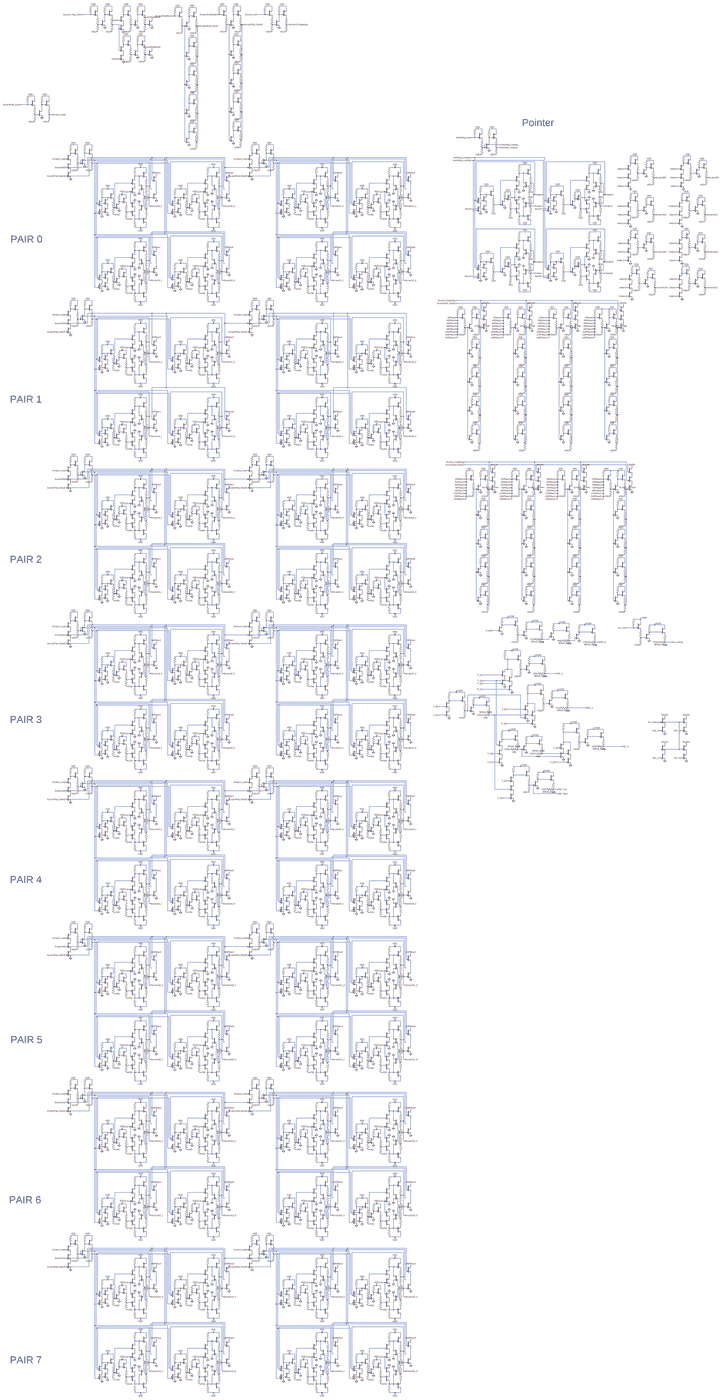
[diagram p0: schematic scratch pad.asc, whole sheet]
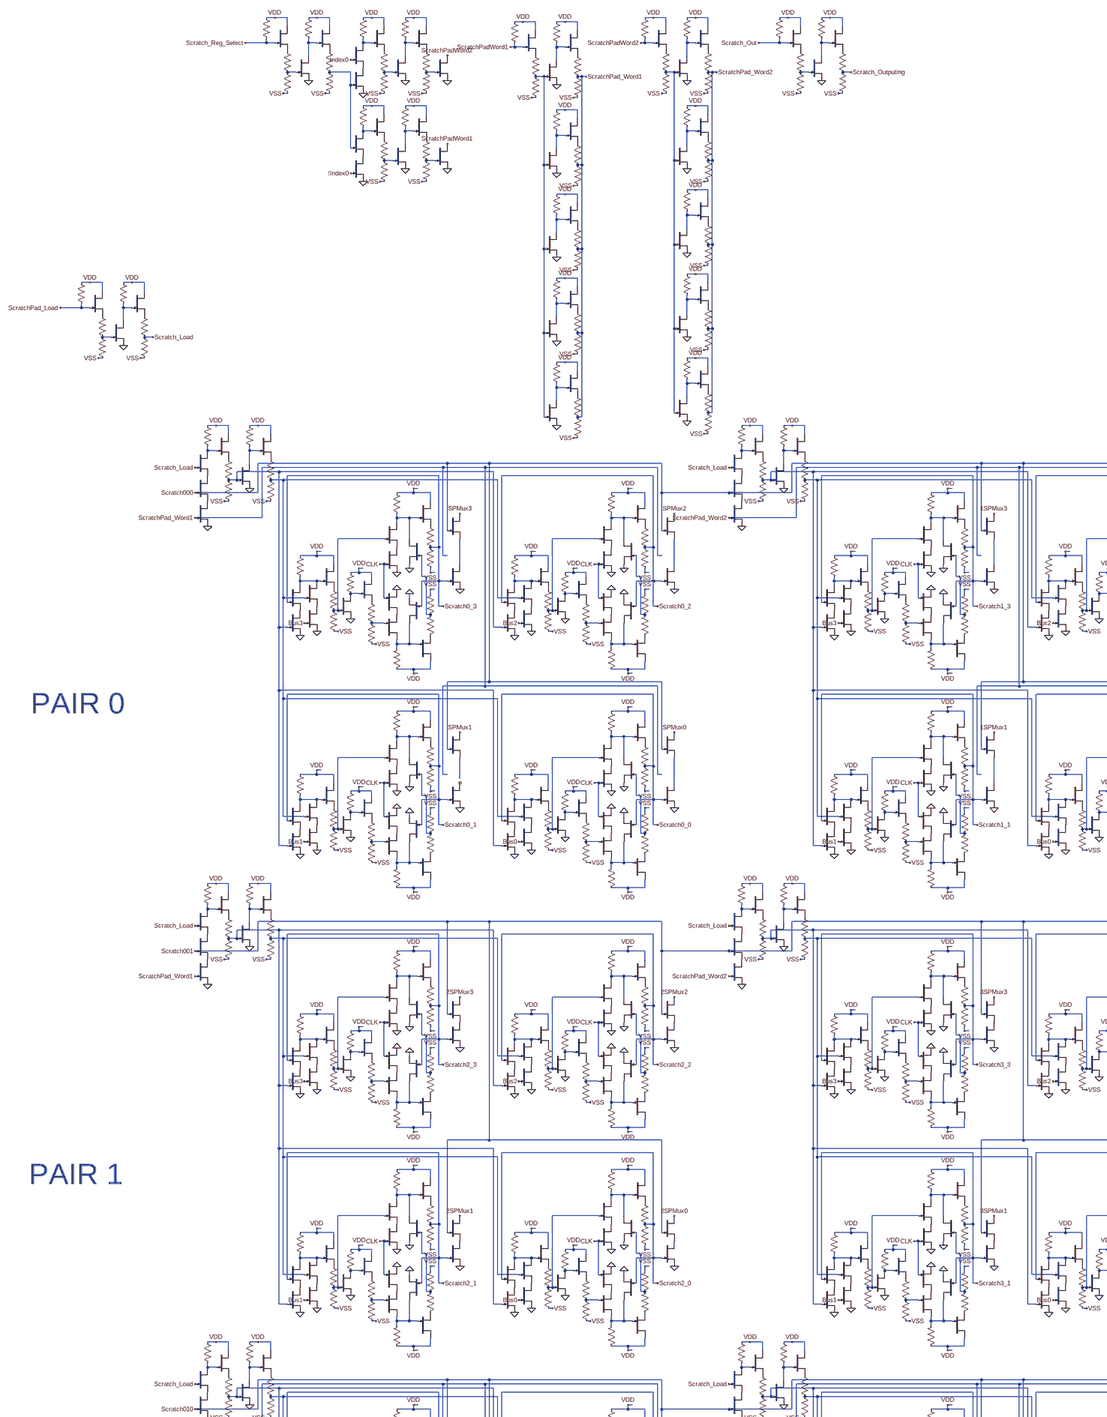
[diagram p1: schematic scratch pad.asc, part, row 1 of 3, column 1 of 2]
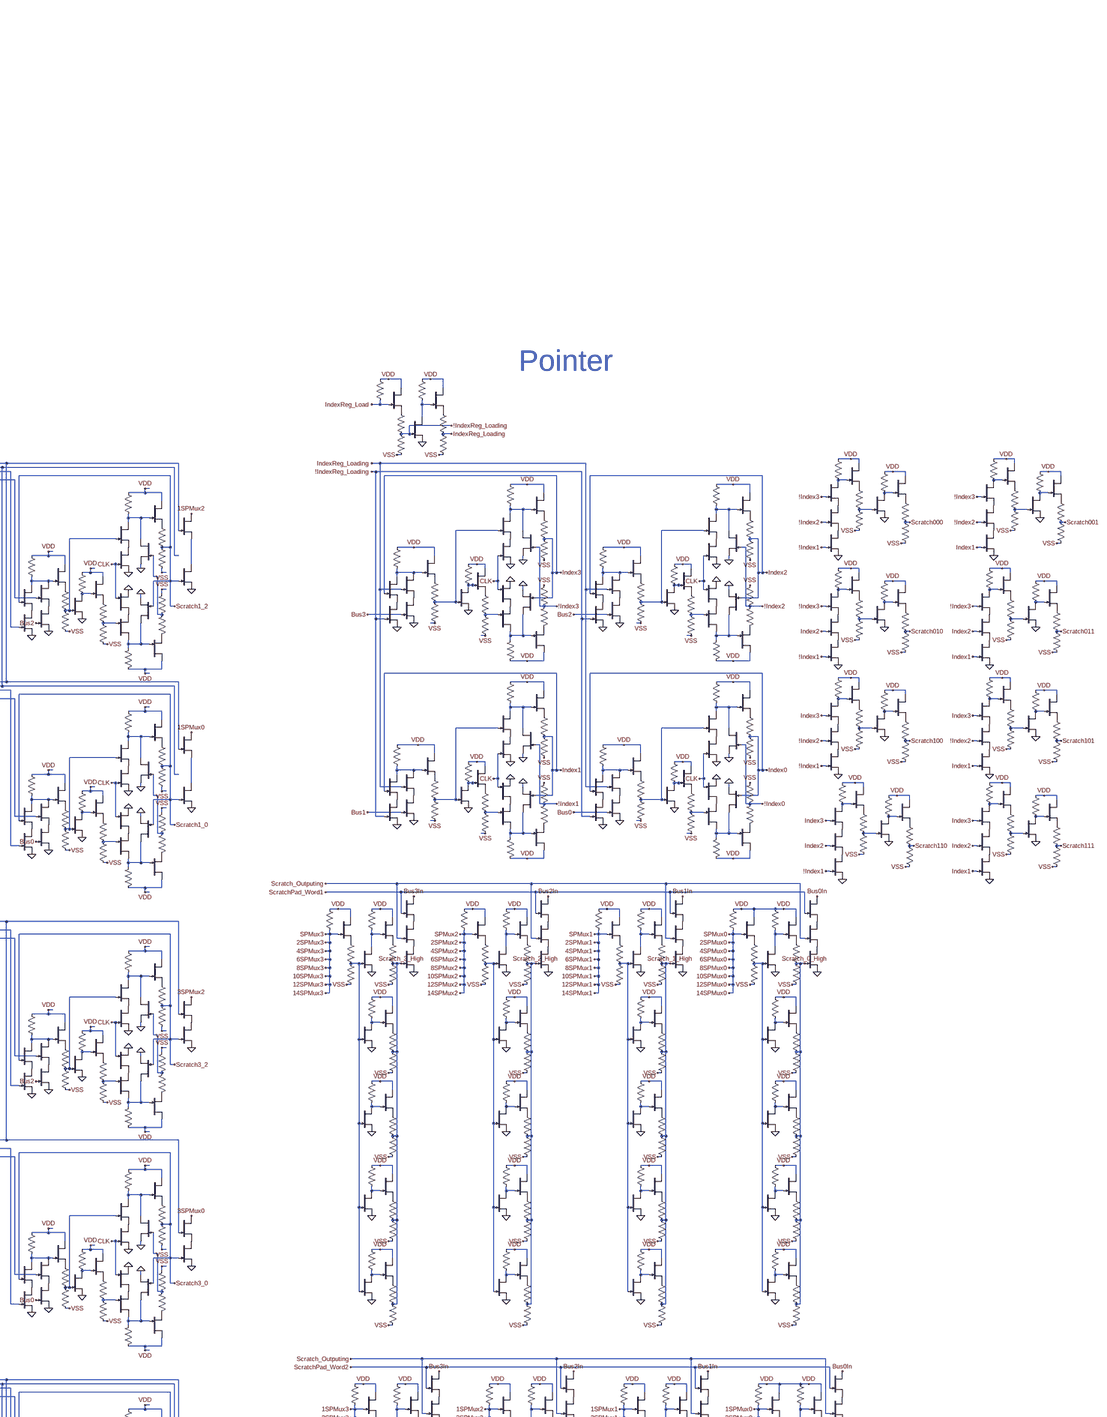
[diagram p2: schematic scratch pad.asc, part, row 1 of 3, column 2 of 2]
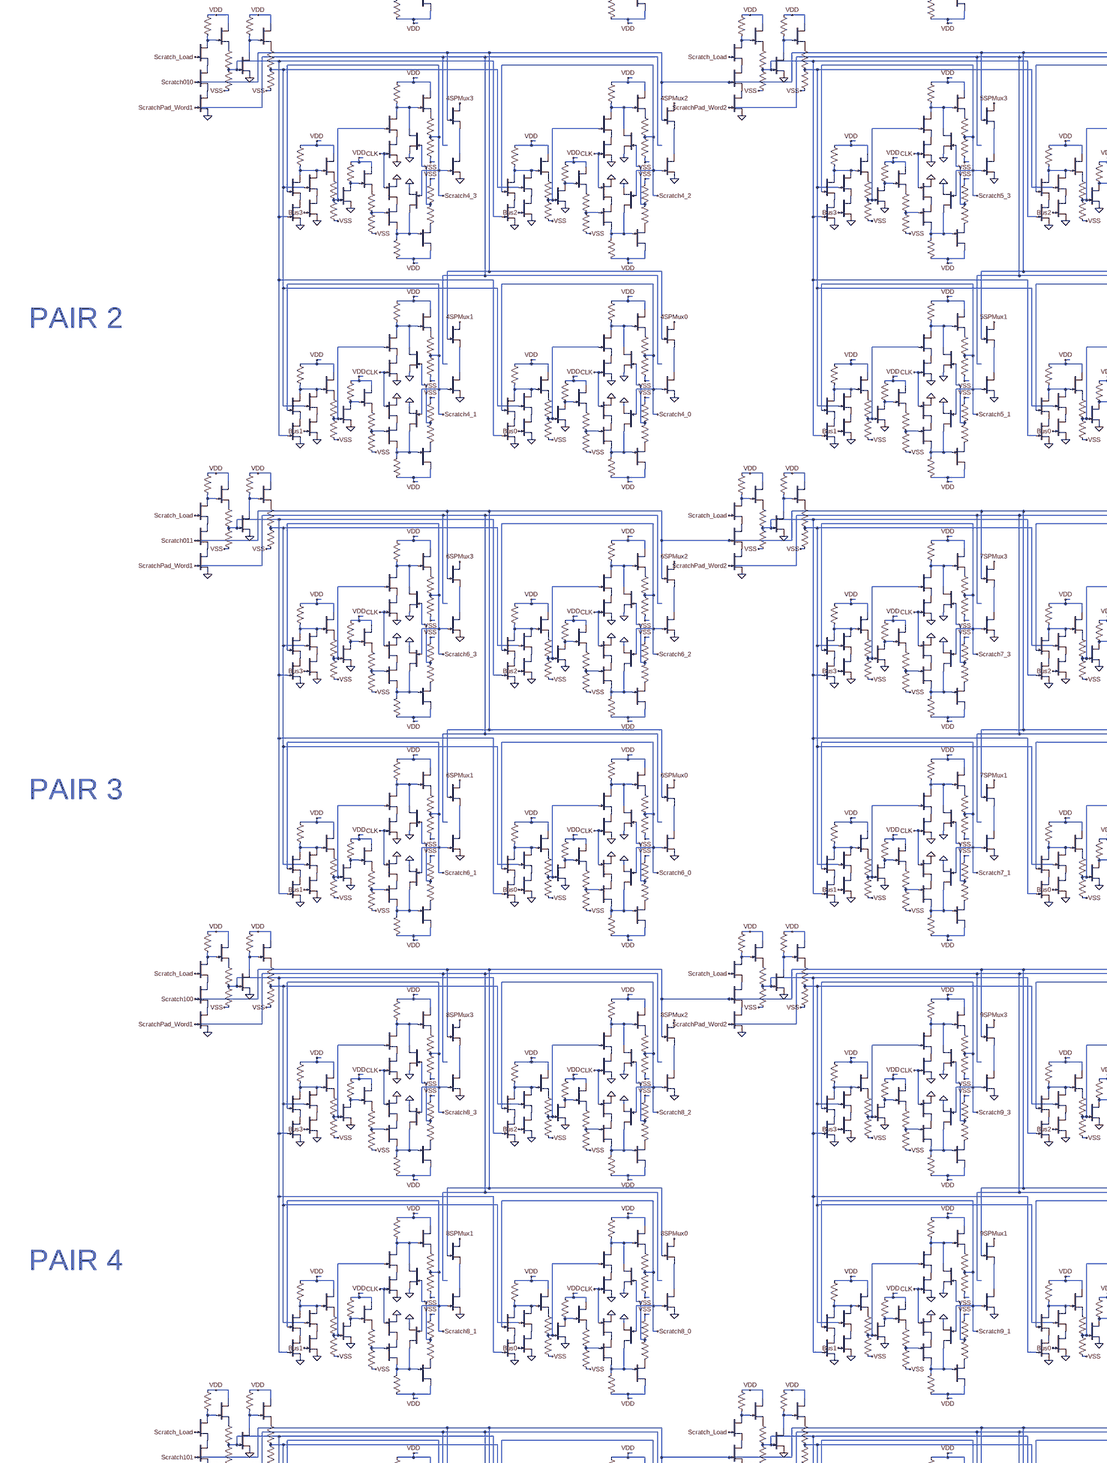
[diagram p3: schematic scratch pad.asc, part, row 2 of 3, column 1 of 2]
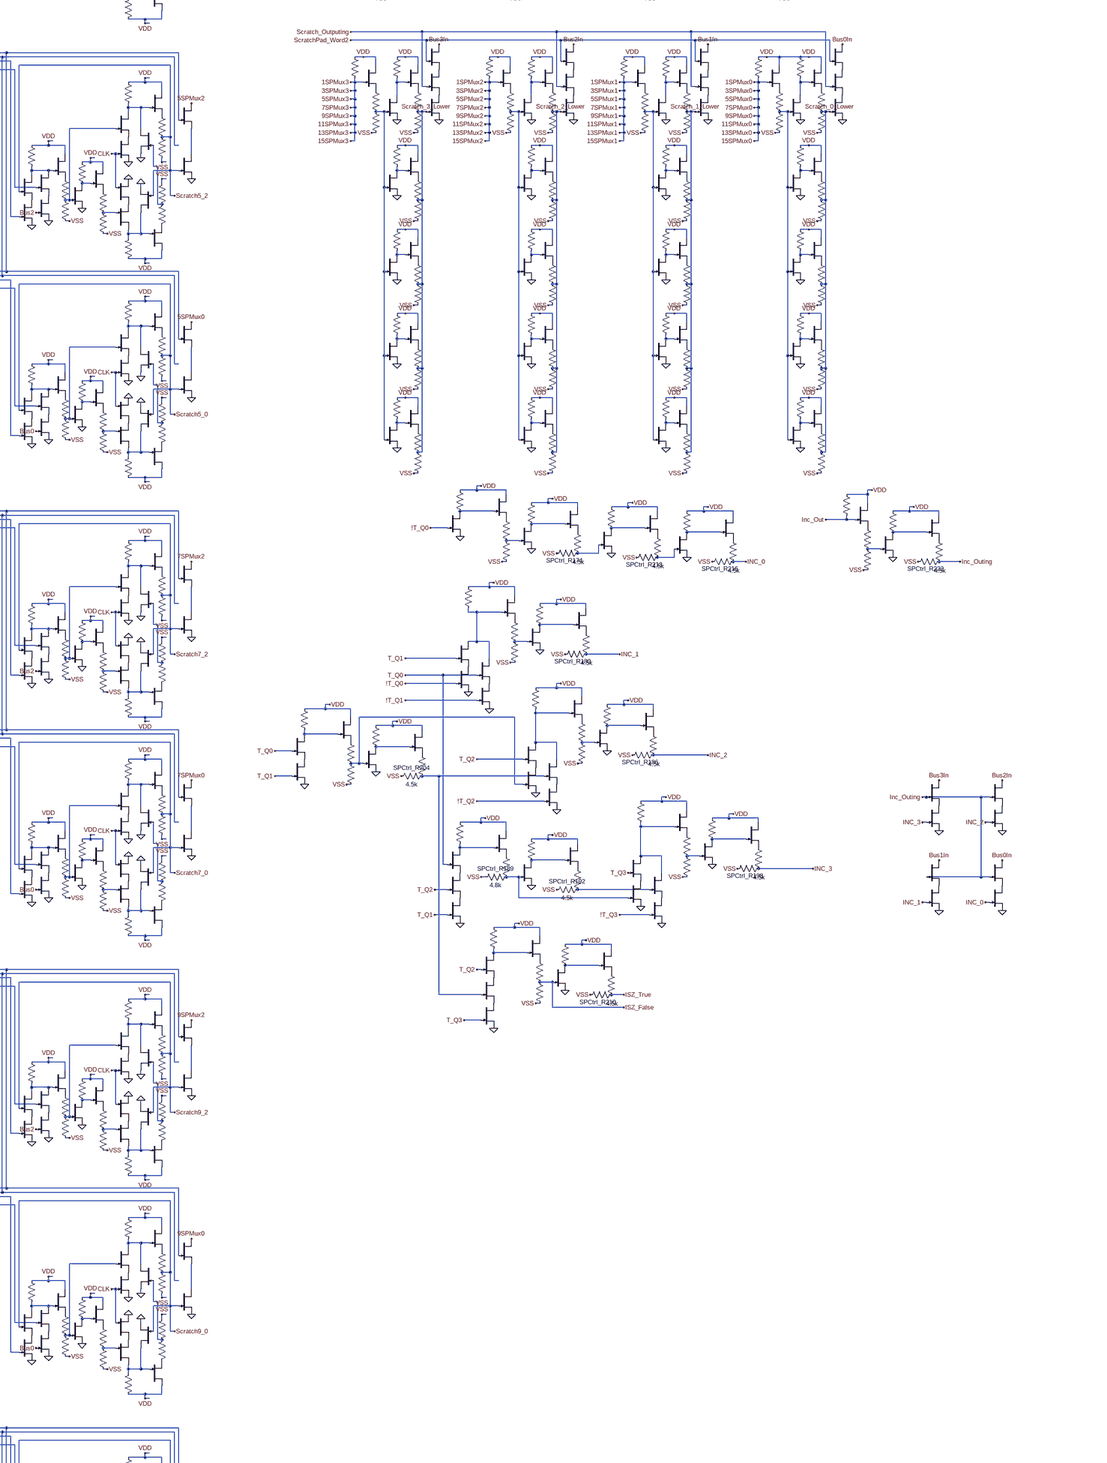
[diagram p4: schematic scratch pad.asc, part, row 2 of 3, column 2 of 2]
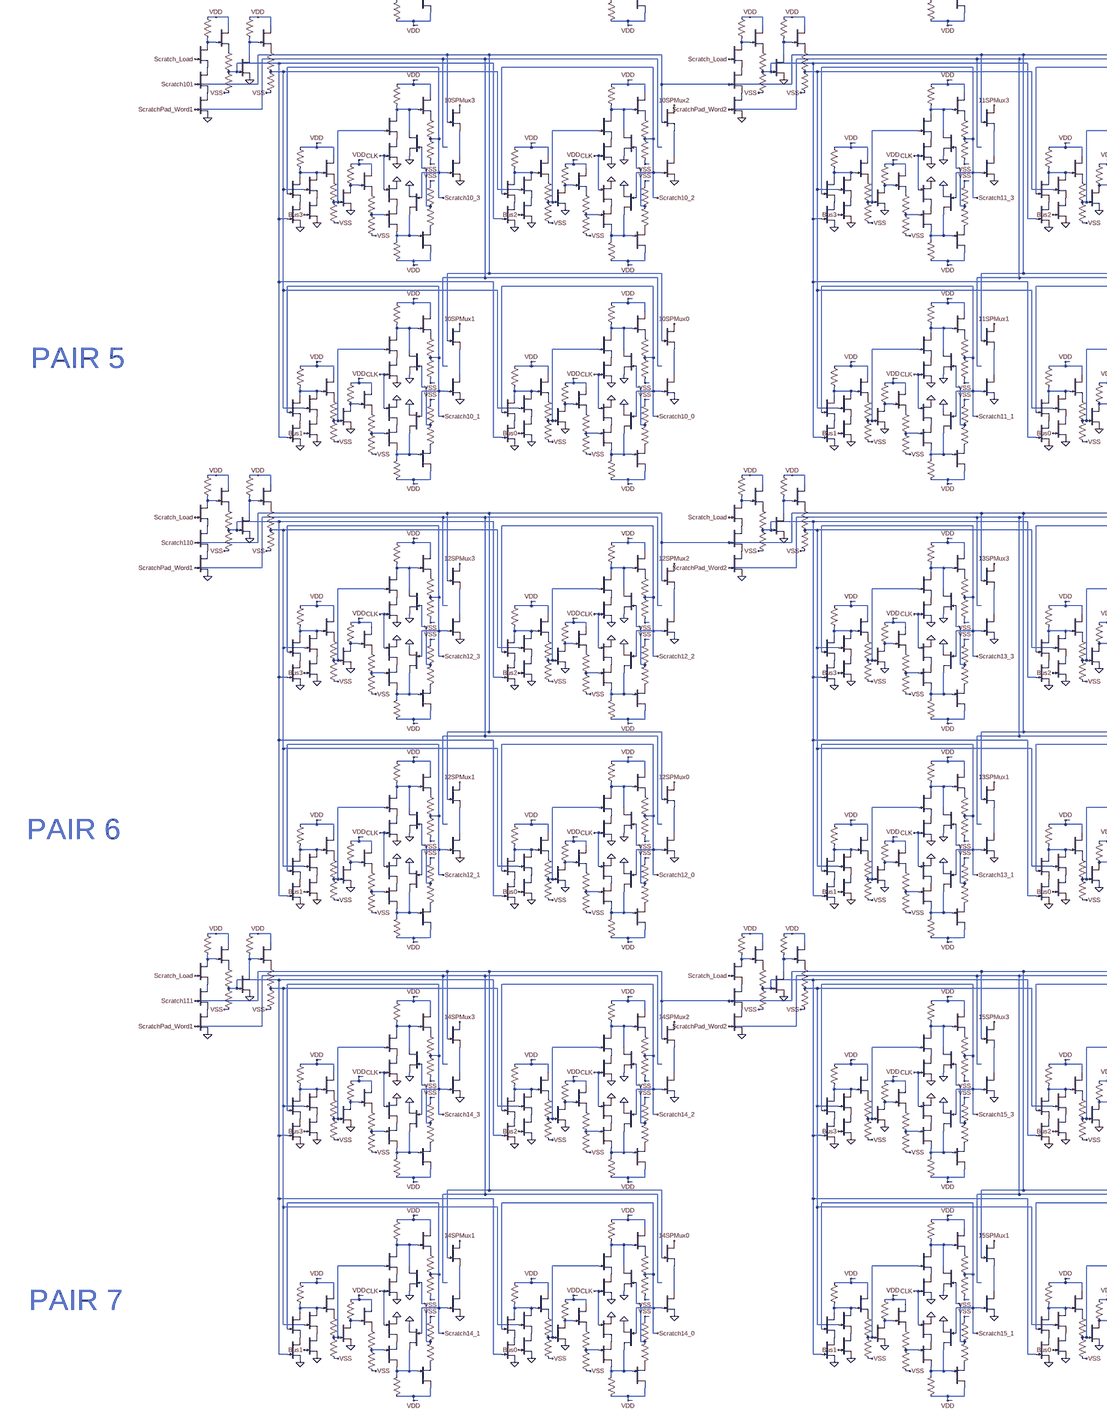
[diagram p5: schematic scratch pad.asc, part, row 3 of 3, column 1 of 2]
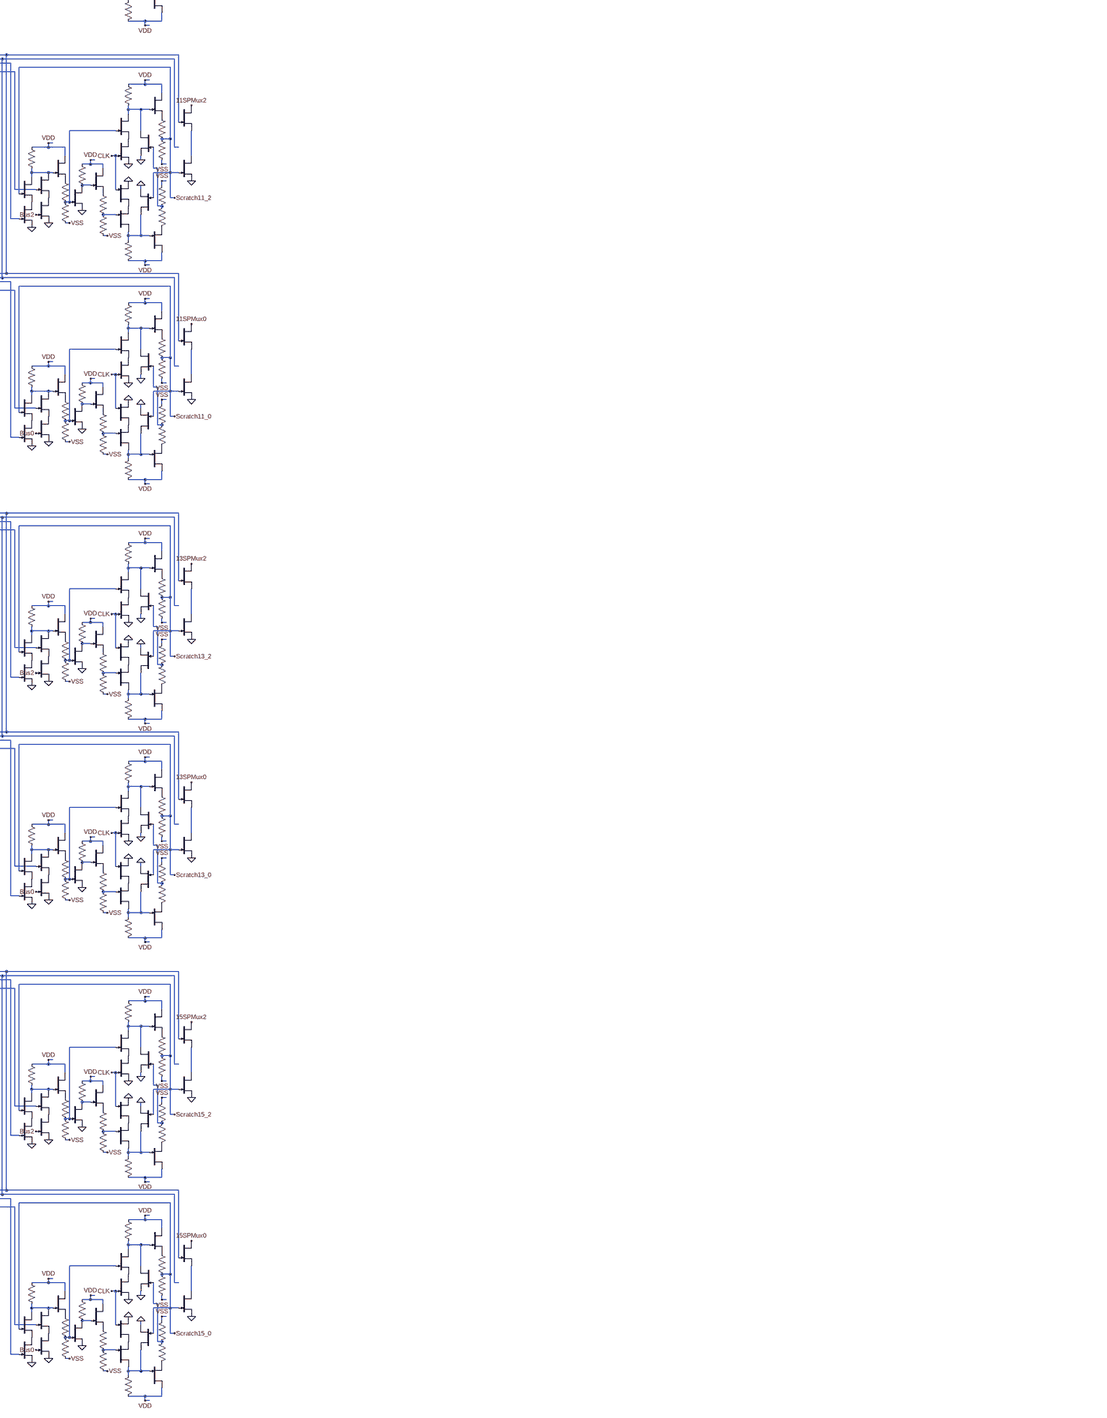
[diagram p6: schematic scratch pad.asc, part, row 3 of 3, column 2 of 2]
* scratch pad.asc
J§SPCtrl_J1 N041 N049 P001 DR
R§SPCtrl_R1 VDD N041 100k
J§SPCtrl_J2 VDD N041 P002 DR
R§SPCtrl_R2 P002 Index3 1k
R§SPCtrl_R3 Index3 VSS 4.8k
J§SPCtrl_J3 N041 !Index3 0 DR
J§SPCtrl_J4 N087 N079 P003 DR
R§SPCtrl_R4 VDD N087 100k
J§SPCtrl_J5 VDD N087 P004 DR
R§SPCtrl_R5 P004 !Index3 1k
R§SPCtrl_R6 !Index3 VSS 4.8k
J§SPCtrl_J6 N087 Index3 0 DR
J§SPCtrl_J7 P001 CLK 0 DR
J§SPCtrl_J8 P003 CLK 0 DR
J§SPCtrl_J9 N059 Index3 P005 DR
R§SPCtrl_R7 VDD N059 100k
J§SPCtrl_J10 VDD N059 P006 DR
R§SPCtrl_R8 P006 N049 1k
R§SPCtrl_R9 N049 VSS 4.8k
J§SPCtrl_J11 N059 IndexReg_Loading P007 DR
J§SPCtrl_J12 N069 N049 0 DR
R§SPCtrl_R10 VDD N069 50k
J§SPCtrl_J13 VDD N069 P008 DR
R§SPCtrl_R11 P008 N079 1k
R§SPCtrl_R12 N079 VSS 4.5k
J§SPCtrl_J14 P005 !IndexReg_Loading 0 DR
J§SPCtrl_J15 P007 Bus3 0 DR
J§SPCtrl_J16 N042 N050 P009 DR
R§SPCtrl_R13 VDD N042 100k
J§SPCtrl_J17 VDD N042 P010 DR
R§SPCtrl_R14 P010 Index2 1k
R§SPCtrl_R15 Index2 VSS 4.8k
J§SPCtrl_J18 N042 !Index2 0 DR
J§SPCtrl_J19 N088 N080 P011 DR
R§SPCtrl_R16 VDD N088 100k
J§SPCtrl_J20 VDD N088 P012 DR
R§SPCtrl_R17 P012 !Index2 1k
R§SPCtrl_R18 !Index2 VSS 4.8k
J§SPCtrl_J21 N088 Index2 0 DR
J§SPCtrl_J22 P009 CLK 0 DR
J§SPCtrl_J23 P011 CLK 0 DR
J§SPCtrl_J24 N060 Index2 P013 DR
R§SPCtrl_R19 VDD N060 100k
J§SPCtrl_J25 VDD N060 P014 DR
R§SPCtrl_R20 P014 N050 1k
R§SPCtrl_R21 N050 VSS 4.8k
J§SPCtrl_J26 N060 IndexReg_Loading P015 DR
J§SPCtrl_J27 N070 N050 0 DR
R§SPCtrl_R22 VDD N070 50k
J§SPCtrl_J28 VDD N070 P016 DR
R§SPCtrl_R23 P016 N080 1k
R§SPCtrl_R24 N080 VSS 4.5k
J§SPCtrl_J29 P013 !IndexReg_Loading 0 DR
J§SPCtrl_J30 P015 Bus2 0 DR
J§SPCtrl_J31 N095 N099 P017 DR
R§SPCtrl_R25 VDD N095 100k
J§SPCtrl_J32 VDD N095 P018 DR
R§SPCtrl_R26 P018 Index1 1k
R§SPCtrl_R27 Index1 VSS 4.8k
J§SPCtrl_J33 N095 !Index1 0 DR
J§SPCtrl_J34 N137 N133 P019 DR
R§SPCtrl_R28 VDD N137 100k
J§SPCtrl_J35 VDD N137 P020 DR
R§SPCtrl_R29 P020 !Index1 1k
R§SPCtrl_R30 !Index1 VSS 4.8k
J§SPCtrl_J36 N137 Index1 0 DR
J§SPCtrl_J37 P017 CLK 0 DR
J§SPCtrl_J38 P019 CLK 0 DR
J§SPCtrl_J39 N111 Index1 P021 DR
R§SPCtrl_R31 VDD N111 100k
J§SPCtrl_J40 VDD N111 P022 DR
R§SPCtrl_R32 P022 N099 1k
R§SPCtrl_R33 N099 VSS 4.8k
J§SPCtrl_J41 N111 IndexReg_Loading P023 DR
J§SPCtrl_J42 N117 N099 0 DR
R§SPCtrl_R34 VDD N117 50k
J§SPCtrl_J43 VDD N117 P024 DR
R§SPCtrl_R35 P024 N133 1k
R§SPCtrl_R36 N133 VSS 4.5k
J§SPCtrl_J44 P021 !IndexReg_Loading 0 DR
J§SPCtrl_J45 P023 Bus1 0 DR
J§SPCtrl_J46 N096 N100 P025 DR
R§SPCtrl_R37 VDD N096 100k
J§SPCtrl_J47 VDD N096 P026 DR
R§SPCtrl_R38 P026 Index0 1k
R§SPCtrl_R39 Index0 VSS 4.8k
J§SPCtrl_J48 N096 !Index0 0 DR
J§SPCtrl_J49 N138 N134 P027 DR
R§SPCtrl_R40 VDD N138 100k
J§SPCtrl_J50 VDD N138 P028 DR
R§SPCtrl_R41 P028 !Index0 1k
R§SPCtrl_R42 !Index0 VSS 4.8k
J§SPCtrl_J51 N138 Index0 0 DR
J§SPCtrl_J52 P025 CLK 0 DR
J§SPCtrl_J53 P027 CLK 0 DR
J§SPCtrl_J54 N112 Index0 P029 DR
R§SPCtrl_R43 VDD N112 100k
J§SPCtrl_J55 VDD N112 P030 DR
R§SPCtrl_R44 P030 N100 1k
R§SPCtrl_R45 N100 VSS 4.8k
J§SPCtrl_J56 N112 IndexReg_Loading P031 DR
J§SPCtrl_J57 N118 N100 0 DR
R§SPCtrl_R46 VDD N118 50k
J§SPCtrl_J58 VDD N118 P032 DR
R§SPCtrl_R47 P032 N134 1k
R§SPCtrl_R48 N134 VSS 4.5k
J§SPCtrl_J59 P029 !IndexReg_Loading 0 DR
J§SPCtrl_J60 P031 Bus0 0 DR
R§SPCtrl_R49 VDD ScratchPad_Load 100k
J§SPCtrl_J61 VDD ScratchPad_Load P033 DR
R§SPCtrl_R50 P033 N025 1k
R§SPCtrl_R51 N025 VSS 4.8k
J§SPCtrl_J62 N024 N025 0 DR
R§SPCtrl_R52 VDD N024 50k
J§SPCtrl_J63 VDD N024 P034 DR
R§SPCtrl_R53 P034 Scratch_Load 1k
R§SPCtrl_R54 VSS Scratch_Load 4.5k
J§SPCtrl_J64 N037 !Index3 P035 DR
R§SPCtrl_R55 VDD N037 100k
J§SPCtrl_J65 VDD N037 P036 DR
R§SPCtrl_R56 P036 N043 1k
R§SPCtrl_R57 N043 VSS 4.8k
J§SPCtrl_J66 P035 !Index2 P037 DR
J§SPCtrl_J67 N039 N043 0 DR
R§SPCtrl_R58 VDD N039 50k
J§SPCtrl_J68 VDD N039 P038 DR
R§SPCtrl_R59 P038 Scratch000 1k
R§SPCtrl_R60 VSS Scratch000 4.5k
J§SPCtrl_J69 P037 !Index1 0 DR
J§SPCtrl_J70 N071 !Index3 P039 DR
R§SPCtrl_R61 VDD N071 100k
J§SPCtrl_J71 VDD N071 P040 DR
R§SPCtrl_R62 P040 N081 1k
R§SPCtrl_R63 N081 VSS 4.8k
J§SPCtrl_J72 P039 Index2 P041 DR
J§SPCtrl_J73 N077 N081 0 DR
R§SPCtrl_R64 VDD N077 50k
J§SPCtrl_J74 VDD N077 P042 DR
R§SPCtrl_R65 P042 Scratch010 1k
R§SPCtrl_R66 VSS Scratch010 4.5k
J§SPCtrl_J75 P041 !Index1 0 DR
J§SPCtrl_J76 N093 Index3 P043 DR
R§SPCtrl_R67 VDD N093 100k
J§SPCtrl_J77 VDD N093 P044 DR
R§SPCtrl_R68 P044 N101 1k
R§SPCtrl_R69 N101 VSS 4.8k
J§SPCtrl_J78 P043 !Index2 P045 DR
J§SPCtrl_J79 N097 N101 0 DR
R§SPCtrl_R70 VDD N097 50k
J§SPCtrl_J80 VDD N097 P046 DR
R§SPCtrl_R71 P046 Scratch100 1k
R§SPCtrl_R72 VSS Scratch100 4.5k
J§SPCtrl_J81 P045 !Index1 0 DR
J§SPCtrl_J82 N127 Index3 P047 DR
R§SPCtrl_R73 VDD N127 100k
J§SPCtrl_J83 VDD N127 P048 DR
R§SPCtrl_R74 P048 N139 1k
R§SPCtrl_R75 N139 VSS 4.8k
J§SPCtrl_J84 P047 Index2 P049 DR
J§SPCtrl_J85 N135 N139 0 DR
R§SPCtrl_R76 VDD N135 50k
J§SPCtrl_J86 VDD N135 P050 DR
R§SPCtrl_R77 P050 Scratch110 1k
R§SPCtrl_R78 VSS Scratch110 4.5k
J§SPCtrl_J87 P049 !Index1 0 DR
J§SPCtrl_J88 N128 Index3 P051 DR
R§SPCtrl_R79 VDD N128 100k
J§SPCtrl_J89 VDD N128 P052 DR
R§SPCtrl_R80 P052 N140 1k
R§SPCtrl_R81 N140 VSS 4.8k
J§SPCtrl_J90 P051 Index2 P053 DR
J§SPCtrl_J91 N136 N140 0 DR
R§SPCtrl_R82 VDD N136 50k
J§SPCtrl_J92 VDD N136 P054 DR
R§SPCtrl_R83 P054 Scratch111 1k
R§SPCtrl_R84 VSS Scratch111 4.5k
J§SPCtrl_J93 P053 Index1 0 DR
J§SPCtrl_J94 N094 Index3 P055 DR
R§SPCtrl_R85 VDD N094 100k
J§SPCtrl_J95 VDD N094 P056 DR
R§SPCtrl_R86 P056 N102 1k
R§SPCtrl_R87 N102 VSS 4.8k
J§SPCtrl_J96 P055 !Index2 P057 DR
J§SPCtrl_J97 N098 N102 0 DR
R§SPCtrl_R88 VDD N098 50k
J§SPCtrl_J98 VDD N098 P058 DR
R§SPCtrl_R89 P058 Scratch101 1k
R§SPCtrl_R90 VSS Scratch101 4.5k
J§SPCtrl_J99 P057 Index1 0 DR
J§SPCtrl_J100 N072 !Index3 P059 DR
R§SPCtrl_R91 VDD N072 100k
J§SPCtrl_J101 VDD N072 P060 DR
R§SPCtrl_R92 P060 N082 1k
R§SPCtrl_R93 N082 VSS 4.8k
J§SPCtrl_J102 P059 Index2 P061 DR
J§SPCtrl_J103 N078 N082 0 DR
R§SPCtrl_R94 VDD N078 50k
J§SPCtrl_J104 VDD N078 P062 DR
R§SPCtrl_R95 P062 Scratch011 1k
R§SPCtrl_R96 VSS Scratch011 4.5k
J§SPCtrl_J105 P061 Index1 0 DR
J§SPCtrl_J106 N038 !Index3 P063 DR
R§SPCtrl_R97 VDD N038 100k
J§SPCtrl_J107 VDD N038 P064 DR
R§SPCtrl_R98 P064 N044 1k
R§SPCtrl_R99 N044 VSS 4.8k
J§SPCtrl_J108 P063 !Index2 P065 DR
J§SPCtrl_J109 N040 N044 0 DR
R§SPCtrl_R100 VDD N040 50k
J§SPCtrl_J110 VDD N040 P066 DR
R§SPCtrl_R101 P066 Scratch001 1k
R§SPCtrl_R102 VSS Scratch001 4.5k
J§SPCtrl_J111 P065 Index1 0 DR
R§SPCtrl_R103 VDD Scratch_Out 100k
J§SPCtrl_J112 VDD Scratch_Out P067 DR
R§SPCtrl_R104 P067 N012 1k
R§SPCtrl_R105 N012 VSS 4.8k
J§SPCtrl_J113 N005 N012 0 DR
R§SPCtrl_R106 VDD N005 50k
J§SPCtrl_J114 VDD N005 P068 DR
R§SPCtrl_R107 P068 Scratch_Outputing 1k
R§SPCtrl_R108 VSS Scratch_Outputing 4.5k
R§SPCtrl_R109 VDD Scratch_Reg_Select 100k
J§SPCtrl_J115 VDD Scratch_Reg_Select P069 DR
R§SPCtrl_R110 P069 N007 1k
R§SPCtrl_R111 N007 VSS 4.8k
J§SPCtrl_J116 N001 N007 0 DR
R§SPCtrl_R112 VDD N001 50k
J§SPCtrl_J117 VDD N001 P070 DR
R§SPCtrl_R113 P070 N008 1k
R§SPCtrl_R114 VSS N008 4.5k
R§SPCtrl_R115 VDD N002 100k
J§SPCtrl_J118 VDD N002 P071 DR
R§SPCtrl_R116 P071 N009 1k
R§SPCtrl_R117 N009 VSS 4.8k
J§SPCtrl_J119 N003 N009 0 DR
R§SPCtrl_R118 VDD N003 50k
J§SPCtrl_J120 VDD N003 P072 DR
R§SPCtrl_R119 P072 N010 1k
R§SPCtrl_R120 VSS N010 4.5k
J§SPCtrl_J121 N002 Index0 P073 DR
J§SPCtrl_J122 P073 N008 0 DR
R§SPCtrl_R121 VDD N014 100k
J§SPCtrl_J123 VDD N014 P074 DR
R§SPCtrl_R122 P074 N018 1k
R§SPCtrl_R123 N018 VSS 4.8k
J§SPCtrl_J124 N015 N018 0 DR
R§SPCtrl_R124 VDD N015 50k
J§SPCtrl_J125 VDD N015 P075 DR
R§SPCtrl_R125 P075 N019 1k
R§SPCtrl_R126 VSS N019 4.5k
J§SPCtrl_J126 N014 N008 P076 DR
J§SPCtrl_J127 P076 !Index0 0 DR
J§SPCtrl_J128 ScratchPadWord2 N010 0 DR
J§SPCtrl_J129 ScratchPadWord1 N019 0 DR
R§SPCtrl_R127 VDD ScratchPadWord1 100k
J§SPCtrl_J130 VDD ScratchPadWord1 P077 DR
R§SPCtrl_R128 P077 N013 1k
R§SPCtrl_R129 N013 VSS 4.8k
J§SPCtrl_J131 N006 N013 0 DR
R§SPCtrl_R130 VDD N006 50k
J§SPCtrl_J132 VDD N006 P078 DR
R§SPCtrl_R131 P078 ScratchPad_Word1 1k
R§SPCtrl_R132 VSS ScratchPad_Word1 4.5k
R§SPCtrl_R133 VDD ScratchPadWord2 100k
J§SPCtrl_J133 VDD ScratchPadWord2 P079 DR
R§SPCtrl_R134 P079 N011 1k
R§SPCtrl_R135 N011 VSS 4.8k
J§SPCtrl_J134 N004 N011 0 DR
R§SPCtrl_R136 VDD N004 50k
J§SPCtrl_J135 VDD N004 P080 DR
R§SPCtrl_R137 P080 ScratchPad_Word2 1k
R§SPCtrl_R138 VSS ScratchPad_Word2 4.5k
R§SPCtrl_R139 VDD IndexReg_Load 100k
J§SPCtrl_J136 VDD IndexReg_Load P081 DR
R§SPCtrl_R140 P081 !IndexReg_Loading 1k
R§SPCtrl_R141 !IndexReg_Loading VSS 4.8k
J§SPCtrl_J137 N028 !IndexReg_Loading 0 DR
R§SPCtrl_R142 VDD N028 50k
J§SPCtrl_J138 VDD N028 P082 DR
R§SPCtrl_R143 P082 IndexReg_Loading 1k
R§SPCtrl_R144 VSS IndexReg_Loading 4.5k
J§SPCtrl_J139 N017 N013 0 DR
R§SPCtrl_R145 VDD N017 50k
J§SPCtrl_J140 VDD N017 P083 DR
R§SPCtrl_R146 P083 ScratchPad_Word1 1k
R§SPCtrl_R147 VSS ScratchPad_Word1 4.5k
J§SPCtrl_J141 N021 N013 0 DR
R§SPCtrl_R148 VDD N021 50k
J§SPCtrl_J142 VDD N021 P084 DR
R§SPCtrl_R149 P084 ScratchPad_Word1 1k
R§SPCtrl_R150 VSS ScratchPad_Word1 4.5k
J§SPCtrl_J143 N023 N013 0 DR
R§SPCtrl_R151 VDD N023 50k
J§SPCtrl_J144 VDD N023 P085 DR
R§SPCtrl_R152 P085 ScratchPad_Word1 1k
R§SPCtrl_R153 VSS ScratchPad_Word1 4.5k
J§SPCtrl_J145 N027 N013 0 DR
R§SPCtrl_R154 VDD N027 50k
J§SPCtrl_J146 VDD N027 P086 DR
R§SPCtrl_R155 P086 ScratchPad_Word1 1k
R§SPCtrl_R156 VSS ScratchPad_Word1 4.5k
J§SPCtrl_J147 N016 N011 0 DR
R§SPCtrl_R157 VDD N016 50k
J§SPCtrl_J148 VDD N016 P087 DR
R§SPCtrl_R158 P087 ScratchPad_Word2 1k
R§SPCtrl_R159 VSS ScratchPad_Word2 4.5k
J§SPCtrl_J149 N020 N011 0 DR
R§SPCtrl_R160 VDD N020 50k
J§SPCtrl_J150 VDD N020 P088 DR
R§SPCtrl_R161 P088 ScratchPad_Word2 1k
R§SPCtrl_R162 VSS ScratchPad_Word2 4.5k
J§SPCtrl_J151 N022 N011 0 DR
R§SPCtrl_R163 VDD N022 50k
J§SPCtrl_J152 VDD N022 P089 DR
R§SPCtrl_R164 P089 ScratchPad_Word2 1k
R§SPCtrl_R165 VSS ScratchPad_Word2 4.5k
J§SPCtrl_J153 N026 N011 0 DR
R§SPCtrl_R166 VDD N026 50k
J§SPCtrl_J154 VDD N026 P090 DR
R§SPCtrl_R167 P090 ScratchPad_Word2 1k
R§SPCtrl_R168 VSS ScratchPad_Word2 4.5k
J§SPCtrl_J155 N337 !T_Q0 0 DR
R§SPCtrl_R169 VDD N337 100k
J§SPCtrl_J156 VDD N337 P091 DR
R§SPCtrl_R170 P091 N346 1k
R§SPCtrl_R171 N346 VSS 4.8k
J§SPCtrl_J157 N340 N346 0 DR
R§SPCtrl_R172 VDD N340 50k
J§SPCtrl_J158 VDD N340 P092 DR
R§SPCtrl_R173 P092 N348 1k
R§SPCtrl_R174 N348 VSS 4.5k
J§SPCtrl_J159 N362 T_Q1 P093 DR
R§SPCtrl_R175 VDD N362 100k
J§SPCtrl_J160 VDD N362 P094 DR
R§SPCtrl_R176 P094 N376 1k
R§SPCtrl_R177 N376 VSS 4.8k
J§SPCtrl_J161 N362 T_Q0 P095 DR
J§SPCtrl_J162 N367 N376 0 DR
R§SPCtrl_R178 VDD N367 50k
J§SPCtrl_J163 VDD N367 P096 DR
R§SPCtrl_R179 P096 INC_1 1k
R§SPCtrl_R180 INC_1 VSS 4.5k
J§SPCtrl_J164 P093 !T_Q0 0 DR
J§SPCtrl_J165 P095 !T_Q1 0 DR
J§SPCtrl_J166 N385 T_Q2 P097 DR
R§SPCtrl_R181 VDD N385 100k
J§SPCtrl_J167 VDD N385 P098 DR
R§SPCtrl_R182 P098 N389 1k
R§SPCtrl_R183 N389 VSS 4.8k
J§SPCtrl_J168 N385 N391 P099 DR
J§SPCtrl_J169 N387 N389 0 DR
R§SPCtrl_R184 VDD N387 50k
J§SPCtrl_J170 VDD N387 P100 DR
R§SPCtrl_R185 P100 INC_2 1k
R§SPCtrl_R186 INC_2 VSS 4.5k
J§SPCtrl_J171 P097 N386 0 DR
J§SPCtrl_J172 P099 !T_Q2 0 DR
R§SPCtrl_R187 VDD N414 100k
J§SPCtrl_J173 VDD N414 P101 DR
R§SPCtrl_R188 P101 N421 1k
R§SPCtrl_R189 N421 VSS 4.8k
J§SPCtrl_J174 N420 N421 0 DR
R§SPCtrl_R190 VDD N420 50k
J§SPCtrl_J175 VDD N420 P102 DR
R§SPCtrl_R191 P102 N426 1k
R§SPCtrl_R192 N426 VSS 4.5k
J§SPCtrl_J176 P103 T_Q1 0 DR
J§SPCtrl_J177 P104 T_Q2 P103 DR
J§SPCtrl_J178 N414 T_Q0 P104 DR
J§SPCtrl_J179 N400 T_Q3 P105 DR
R§SPCtrl_R193 VDD N400 100k
J§SPCtrl_J180 VDD N400 P106 DR
R§SPCtrl_R194 P106 N415 1k
R§SPCtrl_R195 N415 VSS 4.8k
J§SPCtrl_J181 N400 N426 P107 DR
J§SPCtrl_J182 N405 N415 0 DR
R§SPCtrl_R196 VDD N405 50k
J§SPCtrl_J183 VDD N405 P108 DR
R§SPCtrl_R197 P108 INC_3 1k
R§SPCtrl_R198 INC_3 VSS 4.5k
J§SPCtrl_J184 P105 N421 0 DR
J§SPCtrl_J185 P107 !T_Q3 0 DR
J§SPCtrl_J186 N388 T_Q0 P109 DR
R§SPCtrl_R199 VDD N388 100k
J§SPCtrl_J187 VDD N388 P110 DR
R§SPCtrl_R200 P110 N386 1k
R§SPCtrl_R201 N386 VSS 4.8k
J§SPCtrl_J188 N390 N386 0 DR
R§SPCtrl_R202 VDD N390 50k
J§SPCtrl_J189 VDD N390 P111 DR
R§SPCtrl_R203 P111 N391 1k
R§SPCtrl_R204 N391 VSS 4.5k
J§SPCtrl_J190 P109 T_Q1 0 DR
J§SPCtrl_J191 N431 T_Q2 P112 DR
J§SPCtrl_J192 P112 N391 P113 DR
R§SPCtrl_R205 VDD N431 100k
J§SPCtrl_J193 VDD N431 P114 DR
R§SPCtrl_R206 P114 ISZ_False 1k
R§SPCtrl_R207 ISZ_False VSS 4.8k
J§SPCtrl_J194 N436 ISZ_False 0 DR
R§SPCtrl_R208 VDD N436 50k
J§SPCtrl_J195 VDD N436 P115 DR
R§SPCtrl_R209 P115 ISZ_True 1k
R§SPCtrl_R210 ISZ_True VSS 4.5k
J§SPCtrl_J196 P113 T_Q3 0 DR
J§SPCtrl_J197 N343 N348 0 DR
R§SPCtrl_R211 VDD N343 50k
J§SPCtrl_J198 VDD N343 P116 DR
R§SPCtrl_R212 P116 N349 1k
R§SPCtrl_R213 N349 VSS 4.5k
J§SPCtrl_J199 N344 N349 0 DR
R§SPCtrl_R214 VDD N344 50k
J§SPCtrl_J200 VDD N344 P117 DR
R§SPCtrl_R215 P117 INC_0 1k
R§SPCtrl_R216 INC_0 VSS 4.5k
J§SPCtrl_J201 P118 INC_3 0 DR
J§SPCtrl_J202 Bus3In Inc_Outing P118 DR
J§SPCtrl_J203 P119 INC_2 0 DR
J§SPCtrl_J204 Bus2In Inc_Outing P119 DR
J§SPCtrl_J205 P120 INC_1 0 DR
J§SPCtrl_J206 Bus1In Inc_Outing P120 DR
J§SPCtrl_J207 P121 INC_0 0 DR
J§SPCtrl_J208 Bus0In Inc_Outing P121 DR
R§SPCtrl_R217 VDD Inc_Out 100k
J§SPCtrl_J209 VDD Inc_Out P122 DR
R§SPCtrl_R218 P122 N347 1k
R§SPCtrl_R219 N347 VSS 4.8k
J§SPCtrl_J210 N345 N347 0 DR
R§SPCtrl_R220 VDD N345 50k
J§SPCtrl_J211 VDD N345 P123 DR
R§SPCtrl_R221 P123 Inc_Outing 1k
R§SPCtrl_R222 Inc_Outing VSS 4.5k
R§SPBus1_R1 VDD 14SPMux3 100k
J§SPBus1_J1 VDD 14SPMux3 P124 DR
R§SPBus1_R2 P124 N161 1k
R§SPBus1_R3 N161 VSS 4.8k
J§SPBus1_J2 N155 N161 0 DR
R§SPBus1_R4 VDD N155 50k
J§SPBus1_J3 VDD N155 P125 DR
R§SPBus1_R5 P125 Scratch_3_High 1k
R§SPBus1_R6 VSS Scratch_3_High 4.5k
J§SPBus1_J4 P126 Scratch_3_High 0 DR
R§SPBus1_R7 VDD 14SPMux2 100k
J§SPBus1_J5 VDD 14SPMux2 P127 DR
R§SPBus1_R8 P127 N162 1k
R§SPBus1_R9 N162 VSS 4.8k
J§SPBus1_J6 N156 N162 0 DR
R§SPBus1_R10 VDD N156 50k
J§SPBus1_J7 VDD N156 P128 DR
R§SPBus1_R11 P128 Scratch_2_High 1k
R§SPBus1_R12 VSS Scratch_2_High 4.5k
J§SPBus1_J8 P129 Scratch_2_High 0 DR
R§SPBus1_R13 VDD 14SPMux1 100k
J§SPBus1_J9 VDD 14SPMux1 P130 DR
R§SPBus1_R14 P130 N163 1k
R§SPBus1_R15 N163 VSS 4.8k
J§SPBus1_J10 N157 N163 0 DR
R§SPBus1_R16 VDD N157 50k
J§SPBus1_J11 VDD N157 P131 DR
R§SPBus1_R17 P131 Scratch_1_High 1k
R§SPBus1_R18 VSS Scratch_1_High 4.5k
J§SPBus1_J12 P132 Scratch_1_High 0 DR
R§SPBus1_R19 VDD 14SPMux0 100k
J§SPBus1_J13 VDD 14SPMux0 P133 DR
R§SPBus1_R20 P133 N164 1k
R§SPBus1_R21 N164 VSS 4.8k
J§SPBus1_J14 N158 N164 0 DR
R§SPBus1_R22 VDD N158 50k
J§SPBus1_J15 VDD N158 P134 DR
R§SPBus1_R23 P134 Scratch_0_High 1k
R§SPBus1_R24 VSS Scratch_0_High 4.5k
J§SPBus1_J16 P135 Scratch_0_High 0 DR
J§SPBus1_J17 P136 Scratch_Outputing P126 DR
J§SPBus1_J18 P137 Scratch_Outputing P129 DR
J§SPBus1_J19 P138 Scratch_Outputing P132 DR
J§SPBus1_J20 P139 Scratch_Outputing P135 DR
J§SPBus1_J21 N173 N161 0 DR
R§SPBus1_R25 VDD N173 50k
J§SPBus1_J22 VDD N173 P140 DR
R§SPBus1_R26 P140 Scratch_3_High 1k
R§SPBus1_R27 VSS Scratch_3_High 4.5k
J§SPBus1_J23 N197 N161 0 DR
R§SPBus1_R28 VDD N197 50k
J§SPBus1_J24 VDD N197 P141 DR
R§SPBus1_R29 P141 Scratch_3_High 1k
R§SPBus1_R30 VSS Scratch_3_High 4.5k
J§SPBus1_J25 N201 N161 0 DR
R§SPBus1_R31 VDD N201 50k
J§SPBus1_J26 VDD N201 P142 DR
R§SPBus1_R32 P142 Scratch_3_High 1k
R§SPBus1_R33 VSS Scratch_3_High 4.5k
J§SPBus1_J27 N225 N161 0 DR
R§SPBus1_R34 VDD N225 50k
J§SPBus1_J28 VDD N225 P143 DR
R§SPBus1_R35 P143 Scratch_3_High 1k
R§SPBus1_R36 VSS Scratch_3_High 4.5k
J§SPBus1_J29 N174 N162 0 DR
R§SPBus1_R37 VDD N174 50k
J§SPBus1_J30 VDD N174 P144 DR
R§SPBus1_R38 P144 Scratch_2_High 1k
R§SPBus1_R39 VSS Scratch_2_High 4.5k
J§SPBus1_J31 N198 N162 0 DR
R§SPBus1_R40 VDD N198 50k
J§SPBus1_J32 VDD N198 P145 DR
R§SPBus1_R41 P145 Scratch_2_High 1k
R§SPBus1_R42 VSS Scratch_2_High 4.5k
J§SPBus1_J33 N202 N162 0 DR
R§SPBus1_R43 VDD N202 50k
J§SPBus1_J34 VDD N202 P146 DR
R§SPBus1_R44 P146 Scratch_2_High 1k
R§SPBus1_R45 VSS Scratch_2_High 4.5k
J§SPBus1_J35 N226 N162 0 DR
R§SPBus1_R46 VDD N226 50k
J§SPBus1_J36 VDD N226 P147 DR
R§SPBus1_R47 P147 Scratch_2_High 1k
R§SPBus1_R48 VSS Scratch_2_High 4.5k
J§SPBus1_J37 N175 N163 0 DR
R§SPBus1_R49 VDD N175 50k
J§SPBus1_J38 VDD N175 P148 DR
R§SPBus1_R50 P148 Scratch_1_High 1k
R§SPBus1_R51 VSS Scratch_1_High 4.5k
J§SPBus1_J39 N199 N163 0 DR
R§SPBus1_R52 VDD N199 50k
J§SPBus1_J40 VDD N199 P149 DR
R§SPBus1_R53 P149 Scratch_1_High 1k
R§SPBus1_R54 VSS Scratch_1_High 4.5k
J§SPBus1_J41 N203 N163 0 DR
R§SPBus1_R55 VDD N203 50k
J§SPBus1_J42 VDD N203 P150 DR
R§SPBus1_R56 P150 Scratch_1_High 1k
R§SPBus1_R57 VSS Scratch_1_High 4.5k
J§SPBus1_J43 N227 N163 0 DR
R§SPBus1_R58 VDD N227 50k
J§SPBus1_J44 VDD N227 P151 DR
R§SPBus1_R59 P151 Scratch_1_High 1k
R§SPBus1_R60 VSS Scratch_1_High 4.5k
J§SPBus1_J45 N176 N164 0 DR
R§SPBus1_R61 VDD N176 50k
J§SPBus1_J46 VDD N176 P152 DR
R§SPBus1_R62 P152 Scratch_0_High 1k
R§SPBus1_R63 VSS Scratch_0_High 4.5k
J§SPBus1_J47 N200 N164 0 DR
R§SPBus1_R64 VDD N200 50k
J§SPBus1_J48 VDD N200 P153 DR
R§SPBus1_R65 P153 Scratch_0_High 1k
R§SPBus1_R66 VSS Scratch_0_High 4.5k
J§SPBus1_J49 N204 N164 0 DR
R§SPBus1_R67 VDD N204 50k
J§SPBus1_J50 VDD N204 P154 DR
R§SPBus1_R68 P154 Scratch_0_High 1k
R§SPBus1_R69 VSS Scratch_0_High 4.5k
J§SPBus1_J51 N228 N164 0 DR
R§SPBus1_R70 VDD N228 50k
J§SPBus1_J52 VDD N228 P155 DR
R§SPBus1_R71 P155 Scratch_0_High 1k
R§SPBus1_R72 VSS Scratch_0_High 4.5k
J§SPPair1_J1 N045 N051 P156 DR
R§SPPair1_R1 VDD N045 100k
J§SPPair1_J2 VDD N045 P157 DR
R§SPPair1_R2 P157 Scratch0_3 1k
R§SPPair1_R3 Scratch0_3 VSS 4.8k
J§SPPair1_J3 N045 N061 0 DR
J§SPPair1_J4 N089 N083 P158 DR
R§SPPair1_R4 VDD N089 100k
J§SPPair1_J5 VDD N089 P159 DR
R§SPPair1_R5 P159 N061 1k
R§SPPair1_R6 N061 VSS 4.8k
J§SPPair1_J6 N089 Scratch0_3 0 DR
J§SPPair1_J7 P156 CLK 0 DR
J§SPPair1_J8 P158 CLK 0 DR
J§SPPair1_J9 N065 Scratch0_3 P160 DR
R§SPPair1_R7 VDD N065 100k
J§SPPair1_J10 VDD N065 P161 DR
R§SPPair1_R8 P161 N051 1k
R§SPPair1_R9 N051 VSS 4.8k
J§SPPair1_J11 N065 N035 P162 DR
J§SPPair1_J12 N073 N051 0 DR
R§SPPair1_R10 VDD N073 50k
J§SPPair1_J13 VDD N073 P163 DR
R§SPPair1_R11 P163 N083 1k
R§SPPair1_R12 N083 VSS 4.5k
J§SPPair1_J14 P160 N033 0 DR
J§SPPair1_J15 P162 Bus3 0 DR
J§SPPair1_J16 N055 Scratch0_3 0 DR
J§SPPair1_J18 14SPMux3 Scratch000 N055 DR
J§SPPair1_J19 N046 N052 P164 DR
R§SPPair1_R13 VDD N046 100k
J§SPPair1_J20 VDD N046 P165 DR
R§SPPair1_R14 P165 Scratch0_2 1k
R§SPPair1_R15 Scratch0_2 VSS 4.8k
J§SPPair1_J21 N046 N062 0 DR
J§SPPair1_J22 N090 N084 P166 DR
R§SPPair1_R16 VDD N090 100k
J§SPPair1_J23 VDD N090 P167 DR
R§SPPair1_R17 P167 N062 1k
R§SPPair1_R18 N062 VSS 4.8k
J§SPPair1_J24 N090 Scratch0_2 0 DR
J§SPPair1_J25 P164 CLK 0 DR
J§SPPair1_J26 P166 CLK 0 DR
J§SPPair1_J27 N066 Scratch0_2 P168 DR
R§SPPair1_R19 VDD N066 100k
J§SPPair1_J28 VDD N066 P169 DR
R§SPPair1_R20 P169 N052 1k
R§SPPair1_R21 N052 VSS 4.8k
J§SPPair1_J29 N066 N035 P170 DR
J§SPPair1_J30 N074 N052 0 DR
R§SPPair1_R22 VDD N074 50k
J§SPPair1_J31 VDD N074 P171 DR
R§SPPair1_R23 P171 N084 1k
R§SPPair1_R24 N084 VSS 4.5k
J§SPPair1_J32 P168 N033 0 DR
J§SPPair1_J33 P170 Bus2 0 DR
J§SPPair1_J34 N056 Scratch0_2 0 DR
J§SPPair1_J36 14SPMux2 Scratch000 N056 DR
R§SPPair1_R25 VDD N029 100k
J§SPPair1_J37 VDD N029 P172 DR
R§SPPair1_R26 P172 N033 1k
R§SPPair1_R27 N033 VSS 4.8k
J§SPPair1_J38 N030 N033 0 DR
R§SPPair1_R28 VDD N030 50k
J§SPPair1_J39 VDD N030 P173 DR
R§SPPair1_R29 P173 N035 1k
R§SPPair1_R30 VSS N035 4.5k
J§SPPair1_J40 N029 Scratch_Load P174 DR
J§SPPair1_J41 P174 Scratch000 P175 DR
J§SPPair1_J42 P175 ScratchPad_Word1 0 DR
J§SPPair1_J43 N103 N107 P176 DR
R§SPPair1_R31 VDD N103 100k
J§SPPair1_J44 VDD N103 P177 DR
R§SPPair1_R32 P177 Scratch0_1 1k
R§SPPair1_R33 Scratch0_1 VSS 4.8k
J§SPPair1_J45 N103 N119 0 DR
J§SPPair1_J46 N145 N141 P178 DR
R§SPPair1_R34 VDD N145 100k
J§SPPair1_J47 VDD N145 P179 DR
R§SPPair1_R35 P179 N119 1k
R§SPPair1_R36 N119 VSS 4.8k
J§SPPair1_J48 N145 Scratch0_1 0 DR
J§SPPair1_J49 P176 CLK 0 DR
J§SPPair1_J50 P178 CLK 0 DR
J§SPPair1_J51 N123 Scratch0_1 P180 DR
R§SPPair1_R37 VDD N123 100k
J§SPPair1_J52 VDD N123 P181 DR
R§SPPair1_R38 P181 N107 1k
R§SPPair1_R39 N107 VSS 4.8k
J§SPPair1_J53 N123 N035 P182 DR
J§SPPair1_J54 N129 N107 0 DR
R§SPPair1_R40 VDD N129 50k
J§SPPair1_J55 VDD N129 P183 DR
R§SPPair1_R41 P183 N141 1k
R§SPPair1_R42 N141 VSS 4.5k
J§SPPair1_J56 P180 N033 0 DR
J§SPPair1_J57 P182 Bus1 0 DR
J§SPPair1_J58 NC_01 Scratch0_1 0 DR
J§SPPair1_J60 14SPMux1 Scratch000 N113 DR
J§SPPair1_J61 N104 N108 P184 DR
R§SPPair1_R43 VDD N104 100k
J§SPPair1_J62 VDD N104 P185 DR
R§SPPair1_R44 P185 Scratch0_0 1k
R§SPPair1_R45 Scratch0_0 VSS 4.8k
J§SPPair1_J63 N104 N120 0 DR
J§SPPair1_J64 N146 N142 P186 DR
R§SPPair1_R46 VDD N146 100k
J§SPPair1_J65 VDD N146 P187 DR
R§SPPair1_R47 P187 N120 1k
R§SPPair1_R48 N120 VSS 4.8k
J§SPPair1_J66 N146 Scratch0_0 0 DR
J§SPPair1_J67 P184 CLK 0 DR
J§SPPair1_J68 P186 CLK 0 DR
J§SPPair1_J69 N124 Scratch0_0 P188 DR
R§SPPair1_R49 VDD N124 100k
J§SPPair1_J70 VDD N124 P189 DR
R§SPPair1_R50 P189 N108 1k
R§SPPair1_R51 N108 VSS 4.8k
J§SPPair1_J71 N124 N035 P190 DR
J§SPPair1_J72 N130 N108 0 DR
R§SPPair1_R52 VDD N130 50k
J§SPPair1_J73 VDD N130 P191 DR
R§SPPair1_R53 P191 N142 1k
R§SPPair1_R54 N142 VSS 4.5k
J§SPPair1_J74 P188 N033 0 DR
J§SPPair1_J75 P190 Bus0 0 DR
J§SPPair1_J76 N114 Scratch0_0 0 DR
J§SPPair1_J78 14SPMux0 Scratch000 N114 DR
J§SPPair1_J79 N047 N053 P192 DR
R§SPPair1_R55 VDD N047 100k
J§SPPair1_J80 VDD N047 P193 DR
R§SPPair1_R56 P193 Scratch1_3 1k
R§SPPair1_R57 Scratch1_3 VSS 4.8k
J§SPPair1_J81 N047 N063 0 DR
J§SPPair1_J82 N091 N085 P194 DR
R§SPPair1_R58 VDD N091 100k
J§SPPair1_J83 VDD N091 P195 DR
R§SPPair1_R59 P195 N063 1k
R§SPPair1_R60 N063 VSS 4.8k
J§SPPair1_J84 N091 Scratch1_3 0 DR
J§SPPair1_J85 P192 CLK 0 DR
J§SPPair1_J86 P194 CLK 0 DR
J§SPPair1_J87 N067 Scratch1_3 P196 DR
R§SPPair1_R61 VDD N067 100k
J§SPPair1_J88 VDD N067 P197 DR
R§SPPair1_R62 P197 N053 1k
R§SPPair1_R63 N053 VSS 4.8k
J§SPPair1_J89 N067 N036 P198 DR
J§SPPair1_J90 N075 N053 0 DR
R§SPPair1_R64 VDD N075 50k
J§SPPair1_J91 VDD N075 P199 DR
R§SPPair1_R65 P199 N085 1k
R§SPPair1_R66 N085 VSS 4.5k
J§SPPair1_J92 P196 N034 0 DR
J§SPPair1_J93 P198 Bus3 0 DR
J§SPPair1_J94 N057 Scratch1_3 0 DR
J§SPPair1_J96 15SPMux3 Scratch000 N057 DR
J§SPPair1_J97 N048 N054 P200 DR
R§SPPair1_R67 VDD N048 100k
J§SPPair1_J98 VDD N048 P201 DR
R§SPPair1_R68 P201 Scratch1_2 1k
R§SPPair1_R69 Scratch1_2 VSS 4.8k
J§SPPair1_J99 N048 N064 0 DR
J§SPPair1_J100 N092 N086 P202 DR
R§SPPair1_R70 VDD N092 100k
J§SPPair1_J101 VDD N092 P203 DR
R§SPPair1_R71 P203 N064 1k
R§SPPair1_R72 N064 VSS 4.8k
J§SPPair1_J102 N092 Scratch1_2 0 DR
J§SPPair1_J103 P200 CLK 0 DR
J§SPPair1_J104 P202 CLK 0 DR
J§SPPair1_J105 N068 Scratch1_2 P204 DR
R§SPPair1_R73 VDD N068 100k
J§SPPair1_J106 VDD N068 P205 DR
R§SPPair1_R74 P205 N054 1k
R§SPPair1_R75 N054 VSS 4.8k
J§SPPair1_J107 N068 N036 P206 DR
J§SPPair1_J108 N076 N054 0 DR
R§SPPair1_R76 VDD N076 50k
J§SPPair1_J109 VDD N076 P207 DR
R§SPPair1_R77 P207 N086 1k
R§SPPair1_R78 N086 VSS 4.5k
J§SPPair1_J110 P204 N034 0 DR
J§SPPair1_J111 P206 Bus2 0 DR
J§SPPair1_J112 N058 Scratch1_2 0 DR
J§SPPair1_J114 15SPMux2 Scratch000 N058 DR
R§SPPair1_R79 VDD N031 100k
J§SPPair1_J115 VDD N031 P208 DR
R§SPPair1_R80 P208 N034 1k
R§SPPair1_R81 N034 VSS 4.8k
J§SPPair1_J116 N032 N034 0 DR
R§SPPair1_R82 VDD N032 50k
J§SPPair1_J117 VDD N032 P209 DR
R§SPPair1_R83 P209 N036 1k
R§SPPair1_R84 VSS N036 4.5k
J§SPPair1_J118 N031 Scratch_Load P210 DR
J§SPPair1_J119 P210 Scratch000 P211 DR
J§SPPair1_J120 P211 ScratchPad_Word2 0 DR
J§SPPair1_J121 N105 N109 P212 DR
R§SPPair1_R85 VDD N105 100k
J§SPPair1_J122 VDD N105 P213 DR
R§SPPair1_R86 P213 Scratch1_1 1k
R§SPPair1_R87 Scratch1_1 VSS 4.8k
J§SPPair1_J123 N105 N121 0 DR
J§SPPair1_J124 N147 N143 P214 DR
R§SPPair1_R88 VDD N147 100k
J§SPPair1_J125 VDD N147 P215 DR
R§SPPair1_R89 P215 N121 1k
R§SPPair1_R90 N121 VSS 4.8k
J§SPPair1_J126 N147 Scratch1_1 0 DR
J§SPPair1_J127 P212 CLK 0 DR
J§SPPair1_J128 P214 CLK 0 DR
J§SPPair1_J129 N125 Scratch1_1 P216 DR
R§SPPair1_R91 VDD N125 100k
J§SPPair1_J130 VDD N125 P217 DR
R§SPPair1_R92 P217 N109 1k
R§SPPair1_R93 N109 VSS 4.8k
J§SPPair1_J131 N125 N036 P218 DR
J§SPPair1_J132 N131 N109 0 DR
R§SPPair1_R94 VDD N131 50k
J§SPPair1_J133 VDD N131 P219 DR
R§SPPair1_R95 P219 N143 1k
R§SPPair1_R96 N143 VSS 4.5k
J§SPPair1_J134 P216 N034 0 DR
J§SPPair1_J135 P218 Bus1 0 DR
J§SPPair1_J136 N115 Scratch1_1 0 DR
J§SPPair1_J138 15SPMux1 Scratch000 N115 DR
J§SPPair1_J139 N106 N110 P220 DR
R§SPPair1_R97 VDD N106 100k
J§SPPair1_J140 VDD N106 P221 DR
R§SPPair1_R98 P221 Scratch1_0 1k
R§SPPair1_R99 Scratch1_0 VSS 4.8k
J§SPPair1_J141 N106 N122 0 DR
J§SPPair1_J142 N148 N144 P222 DR
R§SPPair1_R100 VDD N148 100k
J§SPPair1_J143 VDD N148 P223 DR
R§SPPair1_R101 P223 N122 1k
R§SPPair1_R102 N122 VSS 4.8k
J§SPPair1_J144 N148 Scratch1_0 0 DR
J§SPPair1_J145 P220 CLK 0 DR
J§SPPair1_J146 P222 CLK 0 DR
J§SPPair1_J147 N126 Scratch1_0 P224 DR
R§SPPair1_R103 VDD N126 100k
J§SPPair1_J148 VDD N126 P225 DR
R§SPPair1_R104 P225 N110 1k
R§SPPair1_R105 N110 VSS 4.8k
J§SPPair1_J149 N126 N036 P226 DR
J§SPPair1_J150 N132 N110 0 DR
R§SPPair1_R106 VDD N132 50k
J§SPPair1_J151 VDD N132 P227 DR
R§SPPair1_R107 P227 N144 1k
R§SPPair1_R108 N144 VSS 4.5k
J§SPPair1_J152 P224 N034 0 DR
J§SPPair1_J153 P226 Bus0 0 DR
J§SPPair1_J154 N116 Scratch1_0 0 DR
J§SPPair1_J156 15SPMux0 Scratch000 N116 DR
J§SPPair2_J1 N165 N169 P228 DR
R§SPPair2_R1 VDD N165 100k
J§SPPair2_J2 VDD N165 P229 DR
R§SPPair2_R2 P229 Scratch2_3 1k
R§SPPair2_R3 Scratch2_3 VSS 4.8k
J§SPPair2_J3 N165 N177 0 DR
J§SPPair2_J4 N193 N189 P230 DR
R§SPPair2_R4 VDD N193 100k
J§SPPair2_J5 VDD N193 P231 DR
R§SPPair2_R5 P231 N177 1k
R§SPPair2_R6 N177 VSS 4.8k
J§SPPair2_J6 N193 Scratch2_3 0 DR
J§SPPair2_J7 P228 CLK 0 DR
J§SPPair2_J8 P230 CLK 0 DR
J§SPPair2_J9 N181 Scratch2_3 P232 DR
R§SPPair2_R7 VDD N181 100k
J§SPPair2_J10 VDD N181 P233 DR
R§SPPair2_R8 P233 N169 1k
R§SPPair2_R9 N169 VSS 4.8k
J§SPPair2_J11 N181 N159 P234 DR
J§SPPair2_J12 N185 N169 0 DR
R§SPPair2_R10 VDD N185 50k
J§SPPair2_J13 VDD N185 P235 DR
R§SPPair2_R11 P235 N189 1k
R§SPPair2_R12 N189 VSS 4.5k
J§SPPair2_J14 P232 N153 0 DR
J§SPPair2_J15 P234 Bus3 0 DR
J§SPPair2_J16 P236 Scratch2_3 0 DR
J§SPPair2_J18 14SPMux3 Scratch001 P236 DR
J§SPPair2_J19 N166 N170 P237 DR
R§SPPair2_R13 VDD N166 100k
J§SPPair2_J20 VDD N166 P238 DR
R§SPPair2_R14 P238 Scratch2_2 1k
R§SPPair2_R15 Scratch2_2 VSS 4.8k
J§SPPair2_J21 N166 N178 0 DR
J§SPPair2_J22 N194 N190 P239 DR
R§SPPair2_R16 VDD N194 100k
J§SPPair2_J23 VDD N194 P240 DR
R§SPPair2_R17 P240 N178 1k
R§SPPair2_R18 N178 VSS 4.8k
J§SPPair2_J24 N194 Scratch2_2 0 DR
J§SPPair2_J25 P237 CLK 0 DR
J§SPPair2_J26 P239 CLK 0 DR
J§SPPair2_J27 N182 Scratch2_2 P241 DR
R§SPPair2_R19 VDD N182 100k
J§SPPair2_J28 VDD N182 P242 DR
R§SPPair2_R20 P242 N170 1k
R§SPPair2_R21 N170 VSS 4.8k
J§SPPair2_J29 N182 N159 P243 DR
J§SPPair2_J30 N186 N170 0 DR
R§SPPair2_R22 VDD N186 50k
J§SPPair2_J31 VDD N186 P244 DR
R§SPPair2_R23 P244 N190 1k
R§SPPair2_R24 N190 VSS 4.5k
J§SPPair2_J32 P241 N153 0 DR
J§SPPair2_J33 P243 Bus2 0 DR
J§SPPair2_J34 P245 Scratch2_2 0 DR
J§SPPair2_J36 14SPMux2 Scratch001 P245 DR
R§SPPair2_R25 VDD N149 100k
J§SPPair2_J37 VDD N149 P246 DR
R§SPPair2_R26 P246 N153 1k
R§SPPair2_R27 N153 VSS 4.8k
J§SPPair2_J38 N150 N153 0 DR
R§SPPair2_R28 VDD N150 50k
J§SPPair2_J39 VDD N150 P247 DR
R§SPPair2_R29 P247 N159 1k
R§SPPair2_R30 VSS N159 4.5k
J§SPPair2_J40 N149 Scratch_Load P248 DR
J§SPPair2_J41 P248 Scratch001 P249 DR
J§SPPair2_J43 N205 N209 P250 DR
R§SPPair2_R31 VDD N205 100k
J§SPPair2_J44 VDD N205 P251 DR
R§SPPair2_R32 P251 Scratch2_1 1k
R§SPPair2_R33 Scratch2_1 VSS 4.8k
J§SPPair2_J45 N205 N213 0 DR
J§SPPair2_J46 N233 N229 P252 DR
R§SPPair2_R34 VDD N233 100k
J§SPPair2_J47 VDD N233 P253 DR
R§SPPair2_R35 P253 N213 1k
R§SPPair2_R36 N213 VSS 4.8k
J§SPPair2_J48 N233 Scratch2_1 0 DR
J§SPPair2_J49 P250 CLK 0 DR
J§SPPair2_J50 P252 CLK 0 DR
J§SPPair2_J51 N217 Scratch2_1 P254 DR
R§SPPair2_R37 VDD N217 100k
J§SPPair2_J52 VDD N217 P255 DR
R§SPPair2_R38 P255 N209 1k
R§SPPair2_R39 N209 VSS 4.8k
J§SPPair2_J53 N217 N159 P256 DR
J§SPPair2_J54 N221 N209 0 DR
R§SPPair2_R40 VDD N221 50k
J§SPPair2_J55 VDD N221 P257 DR
R§SPPair2_R41 P257 N229 1k
R§SPPair2_R42 N229 VSS 4.5k
J§SPPair2_J56 P254 N153 0 DR
J§SPPair2_J57 P256 Bus1 0 DR
J§SPPair2_J58 P258 Scratch2_1 0 DR
J§SPPair2_J60 14SPMux1 Scratch001 P258 DR
J§SPPair2_J61 N206 N210 P259 DR
R§SPPair2_R43 VDD N206 100k
J§SPPair2_J62 VDD N206 P260 DR
R§SPPair2_R44 P260 Scratch2_0 1k
R§SPPair2_R45 Scratch2_0 VSS 4.8k
J§SPPair2_J63 N206 N214 0 DR
J§SPPair2_J64 N234 N230 P261 DR
R§SPPair2_R46 VDD N234 100k
J§SPPair2_J65 VDD N234 P262 DR
R§SPPair2_R47 P262 N214 1k
R§SPPair2_R48 N214 VSS 4.8k
J§SPPair2_J66 N234 Scratch2_0 0 DR
J§SPPair2_J67 P259 CLK 0 DR
J§SPPair2_J68 P261 CLK 0 DR
J§SPPair2_J69 N218 Scratch2_0 P263 DR
R§SPPair2_R49 VDD N218 100k
J§SPPair2_J70 VDD N218 P264 DR
R§SPPair2_R50 P264 N210 1k
R§SPPair2_R51 N210 VSS 4.8k
J§SPPair2_J71 N218 N159 P265 DR
J§SPPair2_J72 N222 N210 0 DR
R§SPPair2_R52 VDD N222 50k
J§SPPair2_J73 VDD N222 P266 DR
R§SPPair2_R53 P266 N230 1k
R§SPPair2_R54 N230 VSS 4.5k
J§SPPair2_J74 P263 N153 0 DR
J§SPPair2_J75 P265 Bus0 0 DR
J§SPPair2_J76 P267 Scratch2_0 0 DR
J§SPPair2_J78 14SPMux0 Scratch001 P267 DR
J§SPPair2_J79 N167 N171 P268 DR
R§SPPair2_R55 VDD N167 100k
J§SPPair2_J80 VDD N167 P269 DR
R§SPPair2_R56 P269 Scratch3_3 1k
R§SPPair2_R57 Scratch3_3 VSS 4.8k
J§SPPair2_J81 N167 N179 0 DR
J§SPPair2_J82 N195 N191 P270 DR
R§SPPair2_R58 VDD N195 100k
J§SPPair2_J83 VDD N195 P271 DR
R§SPPair2_R59 P271 N179 1k
R§SPPair2_R60 N179 VSS 4.8k
J§SPPair2_J84 N195 Scratch3_3 0 DR
J§SPPair2_J85 P268 CLK 0 DR
J§SPPair2_J86 P270 CLK 0 DR
J§SPPair2_J87 N183 Scratch3_3 P272 DR
R§SPPair2_R61 VDD N183 100k
J§SPPair2_J88 VDD N183 P273 DR
R§SPPair2_R62 P273 N171 1k
R§SPPair2_R63 N171 VSS 4.8k
J§SPPair2_J89 N183 N160 P274 DR
J§SPPair2_J90 N187 N171 0 DR
R§SPPair2_R64 VDD N187 50k
J§SPPair2_J91 VDD N187 P275 DR
R§SPPair2_R65 P275 N191 1k
R§SPPair2_R66 N191 VSS 4.5k
J§SPPair2_J92 P272 N154 0 DR
J§SPPair2_J93 P274 Bus3 0 DR
J§SPPair2_J94 P276 Scratch3_3 0 DR
J§SPPair2_J96 15SPMux3 Scratch001 P276 DR
J§SPPair2_J97 N168 N172 P277 DR
R§SPPair2_R67 VDD N168 100k
J§SPPair2_J98 VDD N168 P278 DR
R§SPPair2_R68 P278 Scratch3_2 1k
R§SPPair2_R69 Scratch3_2 VSS 4.8k
J§SPPair2_J99 N168 N180 0 DR
J§SPPair2_J100 N196 N192 P279 DR
R§SPPair2_R70 VDD N196 100k
J§SPPair2_J101 VDD N196 P280 DR
R§SPPair2_R71 P280 N180 1k
R§SPPair2_R72 N180 VSS 4.8k
J§SPPair2_J102 N196 Scratch3_2 0 DR
J§SPPair2_J103 P277 CLK 0 DR
J§SPPair2_J104 P279 CLK 0 DR
J§SPPair2_J105 N184 Scratch3_2 P281 DR
R§SPPair2_R73 VDD N184 100k
J§SPPair2_J106 VDD N184 P282 DR
R§SPPair2_R74 P282 N172 1k
R§SPPair2_R75 N172 VSS 4.8k
J§SPPair2_J107 N184 N160 P283 DR
J§SPPair2_J108 N188 N172 0 DR
R§SPPair2_R76 VDD N188 50k
J§SPPair2_J109 VDD N188 P284 DR
R§SPPair2_R77 P284 N192 1k
R§SPPair2_R78 N192 VSS 4.5k
J§SPPair2_J110 P281 N154 0 DR
J§SPPair2_J111 P283 Bus2 0 DR
J§SPPair2_J112 P285 Scratch3_2 0 DR
J§SPPair2_J114 15SPMux2 Scratch001 P285 DR
R§SPPair2_R79 VDD N151 100k
J§SPPair2_J115 VDD N151 P286 DR
R§SPPair2_R80 P286 N154 1k
R§SPPair2_R81 N154 VSS 4.8k
J§SPPair2_J116 N152 N154 0 DR
R§SPPair2_R82 VDD N152 50k
J§SPPair2_J117 VDD N152 P287 DR
R§SPPair2_R83 P287 N160 1k
R§SPPair2_R84 VSS N160 4.5k
J§SPPair2_J118 N151 Scratch_Load P288 DR
J§SPPair2_J119 P288 Scratch001 P289 DR
J§SPPair2_J121 N207 N211 P290 DR
R§SPPair2_R85 VDD N207 100k
J§SPPair2_J122 VDD N207 P291 DR
R§SPPair2_R86 P291 Scratch3_1 1k
R§SPPair2_R87 Scratch3_1 VSS 4.8k
J§SPPair2_J123 N207 N215 0 DR
J§SPPair2_J124 N235 N231 P292 DR
R§SPPair2_R88 VDD N235 100k
J§SPPair2_J125 VDD N235 P293 DR
R§SPPair2_R89 P293 N215 1k
R§SPPair2_R90 N215 VSS 4.8k
J§SPPair2_J126 N235 Scratch3_1 0 DR
J§SPPair2_J127 P290 CLK 0 DR
J§SPPair2_J128 P292 CLK 0 DR
J§SPPair2_J129 N219 Scratch3_1 P294 DR
R§SPPair2_R91 VDD N219 100k
J§SPPair2_J130 VDD N219 P295 DR
R§SPPair2_R92 P295 N211 1k
R§SPPair2_R93 N211 VSS 4.8k
J§SPPair2_J131 N219 N160 P296 DR
J§SPPair2_J132 N223 N211 0 DR
R§SPPair2_R94 VDD N223 50k
J§SPPair2_J133 VDD N223 P297 DR
R§SPPair2_R95 P297 N231 1k
R§SPPair2_R96 N231 VSS 4.5k
J§SPPair2_J134 P294 N154 0 DR
J§SPPair2_J135 P296 Bus1 0 DR
J§SPPair2_J136 P298 Scratch3_1 0 DR
J§SPPair2_J138 15SPMux1 Scratch001 P298 DR
J§SPPair2_J139 N208 N212 P299 DR
R§SPPair2_R97 VDD N208 100k
J§SPPair2_J140 VDD N208 P300 DR
R§SPPair2_R98 P300 Scratch3_0 1k
R§SPPair2_R99 Scratch3_0 VSS 4.8k
J§SPPair2_J141 N208 N216 0 DR
J§SPPair2_J142 N236 N232 P301 DR
R§SPPair2_R100 VDD N236 100k
J§SPPair2_J143 VDD N236 P302 DR
R§SPPair2_R101 P302 N216 1k
R§SPPair2_R102 N216 VSS 4.8k
J§SPPair2_J144 N236 Scratch3_0 0 DR
J§SPPair2_J145 P299 CLK 0 DR
J§SPPair2_J146 P301 CLK 0 DR
J§SPPair2_J147 N220 Scratch3_0 P303 DR
R§SPPair2_R103 VDD N220 100k
J§SPPair2_J148 VDD N220 P304 DR
R§SPPair2_R104 P304 N212 1k
R§SPPair2_R105 N212 VSS 4.8k
J§SPPair2_J149 N220 N160 P305 DR
J§SPPair2_J150 N224 N212 0 DR
R§SPPair2_R106 VDD N224 50k
J§SPPair2_J151 VDD N224 P306 DR
R§SPPair2_R107 P306 N232 1k
R§SPPair2_R108 N232 VSS 4.5k
J§SPPair2_J152 P303 N154 0 DR
J§SPPair2_J153 P305 Bus0 0 DR
J§SPPair2_J154 P307 Scratch3_0 0 DR
J§SPPair2_J156 15SPMux0 Scratch001 P307 DR
J§SPPair3_J1 N249 N257 P308 DR
R§SPPair3_R1 VDD N249 100k
J§SPPair3_J2 VDD N249 P309 DR
R§SPPair3_R2 P309 Scratch4_3 1k
R§SPPair3_R3 Scratch4_3 VSS 4.8k
J§SPPair3_J3 N249 N265 0 DR
J§SPPair3_J4 N285 N281 P310 DR
R§SPPair3_R4 VDD N285 100k
J§SPPair3_J5 VDD N285 P311 DR
R§SPPair3_R5 P311 N265 1k
R§SPPair3_R6 N265 VSS 4.8k
J§SPPair3_J6 N285 Scratch4_3 0 DR
J§SPPair3_J7 P308 CLK 0 DR
J§SPPair3_J8 P310 CLK 0 DR
J§SPPair3_J9 N269 Scratch4_3 P312 DR
R§SPPair3_R7 VDD N269 100k
J§SPPair3_J10 VDD N269 P313 DR
R§SPPair3_R8 P313 N257 1k
R§SPPair3_R9 N257 VSS 4.8k
J§SPPair3_J11 N269 N243 P314 DR
J§SPPair3_J12 N277 N257 0 DR
R§SPPair3_R10 VDD N277 50k
J§SPPair3_J13 VDD N277 P315 DR
R§SPPair3_R11 P315 N281 1k
R§SPPair3_R12 N281 VSS 4.5k
J§SPPair3_J14 P312 N241 0 DR
J§SPPair3_J15 P314 Bus3 0 DR
J§SPPair3_J16 N261 Scratch4_3 0 DR
J§SPPair3_J18 14SPMux3 Scratch010 N261 DR
J§SPPair3_J19 N250 N258 P316 DR
R§SPPair3_R13 VDD N250 100k
J§SPPair3_J20 VDD N250 P317 DR
R§SPPair3_R14 P317 Scratch4_2 1k
R§SPPair3_R15 Scratch4_2 VSS 4.8k
J§SPPair3_J21 N250 N266 0 DR
J§SPPair3_J22 N286 N282 P318 DR
R§SPPair3_R16 VDD N286 100k
J§SPPair3_J23 VDD N286 P319 DR
R§SPPair3_R17 P319 N266 1k
R§SPPair3_R18 N266 VSS 4.8k
J§SPPair3_J24 N286 Scratch4_2 0 DR
J§SPPair3_J25 P316 CLK 0 DR
J§SPPair3_J26 P318 CLK 0 DR
J§SPPair3_J27 N270 Scratch4_2 P320 DR
R§SPPair3_R19 VDD N270 100k
J§SPPair3_J28 VDD N270 P321 DR
R§SPPair3_R20 P321 N258 1k
R§SPPair3_R21 N258 VSS 4.8k
J§SPPair3_J29 N270 N243 P322 DR
J§SPPair3_J30 N278 N258 0 DR
R§SPPair3_R22 VDD N278 50k
J§SPPair3_J31 VDD N278 P323 DR
R§SPPair3_R23 P323 N282 1k
R§SPPair3_R24 N282 VSS 4.5k
J§SPPair3_J32 P320 N241 0 DR
J§SPPair3_J33 P322 Bus2 0 DR
J§SPPair3_J34 N262 Scratch4_2 0 DR
J§SPPair3_J36 14SPMux2 Scratch010 N262 DR
R§SPPair3_R25 VDD N237 100k
J§SPPair3_J37 VDD N237 P324 DR
R§SPPair3_R26 P324 N241 1k
R§SPPair3_R27 N241 VSS 4.8k
J§SPPair3_J38 N238 N241 0 DR
R§SPPair3_R28 VDD N238 50k
J§SPPair3_J39 VDD N238 P325 DR
R§SPPair3_R29 P325 N243 1k
R§SPPair3_R30 VSS N243 4.5k
J§SPPair3_J40 N237 Scratch_Load P326 DR
J§SPPair3_J41 P326 Scratch010 P327 DR
J§SPPair3_J42 P327 ScratchPad_Word1 0 DR
J§SPPair3_J43 N293 N301 P328 DR
R§SPPair3_R31 VDD N293 100k
J§SPPair3_J44 VDD N293 P329 DR
R§SPPair3_R32 P329 Scratch4_1 1k
R§SPPair3_R33 Scratch4_1 VSS 4.8k
J§SPPair3_J45 N293 N309 0 DR
J§SPPair3_J46 N329 N325 P330 DR
R§SPPair3_R34 VDD N329 100k
J§SPPair3_J47 VDD N329 P331 DR
R§SPPair3_R35 P331 N309 1k
R§SPPair3_R36 N309 VSS 4.8k
J§SPPair3_J48 N329 Scratch4_1 0 DR
J§SPPair3_J49 P328 CLK 0 DR
J§SPPair3_J50 P330 CLK 0 DR
J§SPPair3_J51 N313 Scratch4_1 P332 DR
R§SPPair3_R37 VDD N313 100k
J§SPPair3_J52 VDD N313 P333 DR
R§SPPair3_R38 P333 N301 1k
R§SPPair3_R39 N301 VSS 4.8k
J§SPPair3_J53 N313 N243 P334 DR
J§SPPair3_J54 N317 N301 0 DR
R§SPPair3_R40 VDD N317 50k
J§SPPair3_J55 VDD N317 P335 DR
R§SPPair3_R41 P335 N325 1k
R§SPPair3_R42 N325 VSS 4.5k
J§SPPair3_J56 P332 N241 0 DR
J§SPPair3_J57 P334 Bus1 0 DR
J§SPPair3_J58 N305 Scratch4_1 0 DR
J§SPPair3_J60 14SPMux1 Scratch010 N305 DR
J§SPPair3_J61 N294 N302 P336 DR
R§SPPair3_R43 VDD N294 100k
J§SPPair3_J62 VDD N294 P337 DR
R§SPPair3_R44 P337 Scratch4_0 1k
R§SPPair3_R45 Scratch4_0 VSS 4.8k
J§SPPair3_J63 N294 N310 0 DR
J§SPPair3_J64 N330 N326 P338 DR
R§SPPair3_R46 VDD N330 100k
J§SPPair3_J65 VDD N330 P339 DR
R§SPPair3_R47 P339 N310 1k
R§SPPair3_R48 N310 VSS 4.8k
J§SPPair3_J66 N330 Scratch4_0 0 DR
J§SPPair3_J67 P336 CLK 0 DR
J§SPPair3_J68 P338 CLK 0 DR
J§SPPair3_J69 N314 Scratch4_0 P340 DR
R§SPPair3_R49 VDD N314 100k
J§SPPair3_J70 VDD N314 P341 DR
R§SPPair3_R50 P341 N302 1k
R§SPPair3_R51 N302 VSS 4.8k
J§SPPair3_J71 N314 N243 P342 DR
J§SPPair3_J72 N318 N302 0 DR
R§SPPair3_R52 VDD N318 50k
J§SPPair3_J73 VDD N318 P343 DR
R§SPPair3_R53 P343 N326 1k
R§SPPair3_R54 N326 VSS 4.5k
J§SPPair3_J74 P340 N241 0 DR
J§SPPair3_J75 P342 Bus0 0 DR
J§SPPair3_J76 N306 Scratch4_0 0 DR
J§SPPair3_J78 14SPMux0 Scratch010 N306 DR
J§SPPair3_J79 N251 N259 P344 DR
R§SPPair3_R55 VDD N251 100k
J§SPPair3_J80 VDD N251 P345 DR
R§SPPair3_R56 P345 Scratch5_3 1k
R§SPPair3_R57 Scratch5_3 VSS 4.8k
J§SPPair3_J81 N251 N267 0 DR
J§SPPair3_J82 N287 N283 P346 DR
R§SPPair3_R58 VDD N287 100k
J§SPPair3_J83 VDD N287 P347 DR
R§SPPair3_R59 P347 N267 1k
R§SPPair3_R60 N267 VSS 4.8k
J§SPPair3_J84 N287 Scratch5_3 0 DR
J§SPPair3_J85 P344 CLK 0 DR
J§SPPair3_J86 P346 CLK 0 DR
J§SPPair3_J87 N271 Scratch5_3 P348 DR
R§SPPair3_R61 VDD N271 100k
J§SPPair3_J88 VDD N271 P349 DR
R§SPPair3_R62 P349 N259 1k
R§SPPair3_R63 N259 VSS 4.8k
J§SPPair3_J89 N271 N244 P350 DR
J§SPPair3_J90 N279 N259 0 DR
R§SPPair3_R64 VDD N279 50k
J§SPPair3_J91 VDD N279 P351 DR
R§SPPair3_R65 P351 N283 1k
R§SPPair3_R66 N283 VSS 4.5k
J§SPPair3_J92 P348 N242 0 DR
J§SPPair3_J93 P350 Bus3 0 DR
J§SPPair3_J94 N263 Scratch5_3 0 DR
J§SPPair3_J96 15SPMux3 Scratch010 N263 DR
J§SPPair3_J97 N252 N260 P352 DR
R§SPPair3_R67 VDD N252 100k
J§SPPair3_J98 VDD N252 P353 DR
R§SPPair3_R68 P353 Scratch5_2 1k
R§SPPair3_R69 Scratch5_2 VSS 4.8k
J§SPPair3_J99 N252 N268 0 DR
J§SPPair3_J100 N288 N284 P354 DR
R§SPPair3_R70 VDD N288 100k
J§SPPair3_J101 VDD N288 P355 DR
R§SPPair3_R71 P355 N268 1k
R§SPPair3_R72 N268 VSS 4.8k
J§SPPair3_J102 N288 Scratch5_2 0 DR
J§SPPair3_J103 P352 CLK 0 DR
J§SPPair3_J104 P354 CLK 0 DR
J§SPPair3_J105 N272 Scratch5_2 P356 DR
R§SPPair3_R73 VDD N272 100k
J§SPPair3_J106 VDD N272 P357 DR
R§SPPair3_R74 P357 N260 1k
R§SPPair3_R75 N260 VSS 4.8k
J§SPPair3_J107 N272 N244 P358 DR
J§SPPair3_J108 N280 N260 0 DR
R§SPPair3_R76 VDD N280 50k
J§SPPair3_J109 VDD N280 P359 DR
R§SPPair3_R77 P359 N284 1k
R§SPPair3_R78 N284 VSS 4.5k
J§SPPair3_J110 P356 N242 0 DR
J§SPPair3_J111 P358 Bus2 0 DR
J§SPPair3_J112 N264 Scratch5_2 0 DR
J§SPPair3_J114 15SPMux2 Scratch010 N264 DR
R§SPPair3_R79 VDD N239 100k
J§SPPair3_J115 VDD N239 P360 DR
R§SPPair3_R80 P360 N242 1k
R§SPPair3_R81 N242 VSS 4.8k
J§SPPair3_J116 N240 N242 0 DR
R§SPPair3_R82 VDD N240 50k
J§SPPair3_J117 VDD N240 P361 DR
R§SPPair3_R83 P361 N244 1k
R§SPPair3_R84 VSS N244 4.5k
J§SPPair3_J118 N239 Scratch_Load P362 DR
J§SPPair3_J119 P362 Scratch010 P363 DR
J§SPPair3_J120 P363 ScratchPad_Word2 0 DR
J§SPPair3_J121 N295 N303 P364 DR
R§SPPair3_R85 VDD N295 100k
J§SPPair3_J122 VDD N295 P365 DR
R§SPPair3_R86 P365 Scratch5_1 1k
R§SPPair3_R87 Scratch5_1 VSS 4.8k
J§SPPair3_J123 N295 N311 0 DR
J§SPPair3_J124 N331 N327 P366 DR
R§SPPair3_R88 VDD N331 100k
J§SPPair3_J125 VDD N331 P367 DR
R§SPPair3_R89 P367 N311 1k
R§SPPair3_R90 N311 VSS 4.8k
J§SPPair3_J126 N331 Scratch5_1 0 DR
J§SPPair3_J127 P364 CLK 0 DR
J§SPPair3_J128 P366 CLK 0 DR
J§SPPair3_J129 N315 Scratch5_1 P368 DR
R§SPPair3_R91 VDD N315 100k
J§SPPair3_J130 VDD N315 P369 DR
R§SPPair3_R92 P369 N303 1k
R§SPPair3_R93 N303 VSS 4.8k
J§SPPair3_J131 N315 N244 P370 DR
J§SPPair3_J132 N319 N303 0 DR
R§SPPair3_R94 VDD N319 50k
J§SPPair3_J133 VDD N319 P371 DR
R§SPPair3_R95 P371 N327 1k
R§SPPair3_R96 N327 VSS 4.5k
J§SPPair3_J134 P368 N242 0 DR
J§SPPair3_J135 P370 Bus1 0 DR
J§SPPair3_J136 N307 Scratch5_1 0 DR
J§SPPair3_J138 15SPMux1 Scratch010 N307 DR
J§SPPair3_J139 N296 N304 P372 DR
R§SPPair3_R97 VDD N296 100k
J§SPPair3_J140 VDD N296 P373 DR
R§SPPair3_R98 P373 Scratch5_0 1k
R§SPPair3_R99 Scratch5_0 VSS 4.8k
J§SPPair3_J141 N296 N312 0 DR
J§SPPair3_J142 N332 N328 P374 DR
R§SPPair3_R100 VDD N332 100k
J§SPPair3_J143 VDD N332 P375 DR
R§SPPair3_R101 P375 N312 1k
R§SPPair3_R102 N312 VSS 4.8k
J§SPPair3_J144 N332 Scratch5_0 0 DR
J§SPPair3_J145 P372 CLK 0 DR
J§SPPair3_J146 P374 CLK 0 DR
J§SPPair3_J147 N316 Scratch5_0 P376 DR
R§SPPair3_R103 VDD N316 100k
J§SPPair3_J148 VDD N316 P377 DR
R§SPPair3_R104 P377 N304 1k
R§SPPair3_R105 N304 VSS 4.8k
J§SPPair3_J149 N316 N244 P378 DR
J§SPPair3_J150 N320 N304 0 DR
R§SPPair3_R106 VDD N320 50k
J§SPPair3_J151 VDD N320 P379 DR
R§SPPair3_R107 P379 N328 1k
R§SPPair3_R108 N328 VSS 4.5k
J§SPPair3_J152 P376 N242 0 DR
J§SPPair3_J153 P378 Bus0 0 DR
J§SPPair3_J154 N308 Scratch5_0 0 DR
J§SPPair3_J156 15SPMux0 Scratch010 N308 DR
J§SPPair4_J1 N350 N354 P380 DR
R§SPPair4_R1 VDD N350 100k
J§SPPair4_J2 VDD N350 P381 DR
R§SPPair4_R2 P381 Scratch6_3 1k
R§SPPair4_R3 Scratch6_3 VSS 4.8k
J§SPPair4_J3 N350 N363 0 DR
J§SPPair4_J4 N381 N377 P382 DR
R§SPPair4_R4 VDD N381 100k
J§SPPair4_J5 VDD N381 P383 DR
R§SPPair4_R5 P383 N363 1k
R§SPPair4_R6 N363 VSS 4.8k
J§SPPair4_J6 N381 Scratch6_3 0 DR
J§SPPair4_J7 P380 CLK 0 DR
J§SPPair4_J8 P382 CLK 0 DR
J§SPPair4_J9 N368 Scratch6_3 P384 DR
R§SPPair4_R7 VDD N368 100k
J§SPPair4_J10 VDD N368 P385 DR
R§SPPair4_R8 P385 N354 1k
R§SPPair4_R9 N354 VSS 4.8k
J§SPPair4_J11 N368 N341 P386 DR
J§SPPair4_J12 N372 N354 0 DR
R§SPPair4_R10 VDD N372 50k
J§SPPair4_J13 VDD N372 P387 DR
R§SPPair4_R11 P387 N377 1k
R§SPPair4_R12 N377 VSS 4.5k
J§SPPair4_J14 P384 N338 0 DR
J§SPPair4_J15 P386 Bus3 0 DR
J§SPPair4_J16 N358 Scratch6_3 0 DR
J§SPPair4_J18 14SPMux3 Scratch011 N358 DR
J§SPPair4_J19 N351 N355 P388 DR
R§SPPair4_R13 VDD N351 100k
J§SPPair4_J20 VDD N351 P389 DR
R§SPPair4_R14 P389 Scratch6_2 1k
R§SPPair4_R15 Scratch6_2 VSS 4.8k
J§SPPair4_J21 N351 N364 0 DR
J§SPPair4_J22 N382 N378 P390 DR
R§SPPair4_R16 VDD N382 100k
J§SPPair4_J23 VDD N382 P391 DR
R§SPPair4_R17 P391 N364 1k
R§SPPair4_R18 N364 VSS 4.8k
J§SPPair4_J24 N382 Scratch6_2 0 DR
J§SPPair4_J25 P388 CLK 0 DR
J§SPPair4_J26 P390 CLK 0 DR
J§SPPair4_J27 N369 Scratch6_2 P392 DR
R§SPPair4_R19 VDD N369 100k
J§SPPair4_J28 VDD N369 P393 DR
R§SPPair4_R20 P393 N355 1k
R§SPPair4_R21 N355 VSS 4.8k
J§SPPair4_J29 N369 N341 P394 DR
J§SPPair4_J30 N373 N355 0 DR
R§SPPair4_R22 VDD N373 50k
J§SPPair4_J31 VDD N373 P395 DR
R§SPPair4_R23 P395 N378 1k
R§SPPair4_R24 N378 VSS 4.5k
J§SPPair4_J32 P392 N338 0 DR
J§SPPair4_J33 P394 Bus2 0 DR
J§SPPair4_J34 N359 Scratch6_2 0 DR
J§SPPair4_J36 14SPMux2 Scratch011 N359 DR
R§SPPair4_R25 VDD N333 100k
J§SPPair4_J37 VDD N333 P396 DR
R§SPPair4_R26 P396 N338 1k
R§SPPair4_R27 N338 VSS 4.8k
J§SPPair4_J38 N334 N338 0 DR
R§SPPair4_R28 VDD N334 50k
J§SPPair4_J39 VDD N334 P397 DR
R§SPPair4_R29 P397 N341 1k
R§SPPair4_R30 VSS N341 4.5k
J§SPPair4_J40 N333 Scratch_Load P398 DR
J§SPPair4_J41 P398 Scratch011 P399 DR
J§SPPair4_J42 P399 ScratchPad_Word1 0 DR
J§SPPair4_J43 N392 N396 P400 DR
R§SPPair4_R31 VDD N392 100k
J§SPPair4_J44 VDD N392 P401 DR
R§SPPair4_R32 P401 Scratch6_1 1k
R§SPPair4_R33 Scratch6_1 VSS 4.8k
J§SPPair4_J45 N392 N406 0 DR
J§SPPair4_J46 N427 N422 P402 DR
R§SPPair4_R34 VDD N427 100k
J§SPPair4_J47 VDD N427 P403 DR
R§SPPair4_R35 P403 N406 1k
R§SPPair4_R36 N406 VSS 4.8k
J§SPPair4_J48 N427 Scratch6_1 0 DR
J§SPPair4_J49 P400 CLK 0 DR
J§SPPair4_J50 P402 CLK 0 DR
J§SPPair4_J51 N410 Scratch6_1 P404 DR
R§SPPair4_R37 VDD N410 100k
J§SPPair4_J52 VDD N410 P405 DR
R§SPPair4_R38 P405 N396 1k
R§SPPair4_R39 N396 VSS 4.8k
J§SPPair4_J53 N410 N341 P406 DR
J§SPPair4_J54 N416 N396 0 DR
R§SPPair4_R40 VDD N416 50k
J§SPPair4_J55 VDD N416 P407 DR
R§SPPair4_R41 P407 N422 1k
R§SPPair4_R42 N422 VSS 4.5k
J§SPPair4_J56 P404 N338 0 DR
J§SPPair4_J57 P406 Bus1 0 DR
J§SPPair4_J58 N401 Scratch6_1 0 DR
J§SPPair4_J60 14SPMux1 Scratch011 N401 DR
J§SPPair4_J61 N393 N397 P408 DR
R§SPPair4_R43 VDD N393 100k
J§SPPair4_J62 VDD N393 P409 DR
R§SPPair4_R44 P409 Scratch6_0 1k
R§SPPair4_R45 Scratch6_0 VSS 4.8k
J§SPPair4_J63 N393 N407 0 DR
J§SPPair4_J64 N428 N423 P410 DR
R§SPPair4_R46 VDD N428 100k
J§SPPair4_J65 VDD N428 P411 DR
R§SPPair4_R47 P411 N407 1k
R§SPPair4_R48 N407 VSS 4.8k
J§SPPair4_J66 N428 Scratch6_0 0 DR
J§SPPair4_J67 P408 CLK 0 DR
J§SPPair4_J68 P410 CLK 0 DR
J§SPPair4_J69 N411 Scratch6_0 P412 DR
R§SPPair4_R49 VDD N411 100k
J§SPPair4_J70 VDD N411 P413 DR
R§SPPair4_R50 P413 N397 1k
R§SPPair4_R51 N397 VSS 4.8k
J§SPPair4_J71 N411 N341 P414 DR
J§SPPair4_J72 N417 N397 0 DR
R§SPPair4_R52 VDD N417 50k
J§SPPair4_J73 VDD N417 P415 DR
R§SPPair4_R53 P415 N423 1k
R§SPPair4_R54 N423 VSS 4.5k
J§SPPair4_J74 P412 N338 0 DR
J§SPPair4_J75 P414 Bus0 0 DR
J§SPPair4_J76 N402 Scratch6_0 0 DR
J§SPPair4_J78 14SPMux0 Scratch011 N402 DR
J§SPPair4_J79 N352 N356 P416 DR
R§SPPair4_R55 VDD N352 100k
J§SPPair4_J80 VDD N352 P417 DR
R§SPPair4_R56 P417 Scratch7_3 1k
R§SPPair4_R57 Scratch7_3 VSS 4.8k
J§SPPair4_J81 N352 N365 0 DR
J§SPPair4_J82 N383 N379 P418 DR
R§SPPair4_R58 VDD N383 100k
J§SPPair4_J83 VDD N383 P419 DR
R§SPPair4_R59 P419 N365 1k
R§SPPair4_R60 N365 VSS 4.8k
J§SPPair4_J84 N383 Scratch7_3 0 DR
J§SPPair4_J85 P416 CLK 0 DR
J§SPPair4_J86 P418 CLK 0 DR
J§SPPair4_J87 N370 Scratch7_3 P420 DR
R§SPPair4_R61 VDD N370 100k
J§SPPair4_J88 VDD N370 P421 DR
R§SPPair4_R62 P421 N356 1k
R§SPPair4_R63 N356 VSS 4.8k
J§SPPair4_J89 N370 N342 P422 DR
J§SPPair4_J90 N374 N356 0 DR
R§SPPair4_R64 VDD N374 50k
J§SPPair4_J91 VDD N374 P423 DR
R§SPPair4_R65 P423 N379 1k
R§SPPair4_R66 N379 VSS 4.5k
J§SPPair4_J92 P420 N339 0 DR
J§SPPair4_J93 P422 Bus3 0 DR
J§SPPair4_J94 N360 Scratch7_3 0 DR
J§SPPair4_J96 15SPMux3 Scratch011 N360 DR
J§SPPair4_J97 N353 N357 P424 DR
R§SPPair4_R67 VDD N353 100k
J§SPPair4_J98 VDD N353 P425 DR
R§SPPair4_R68 P425 Scratch7_2 1k
R§SPPair4_R69 Scratch7_2 VSS 4.8k
J§SPPair4_J99 N353 N366 0 DR
J§SPPair4_J100 N384 N380 P426 DR
R§SPPair4_R70 VDD N384 100k
J§SPPair4_J101 VDD N384 P427 DR
R§SPPair4_R71 P427 N366 1k
R§SPPair4_R72 N366 VSS 4.8k
J§SPPair4_J102 N384 Scratch7_2 0 DR
J§SPPair4_J103 P424 CLK 0 DR
J§SPPair4_J104 P426 CLK 0 DR
J§SPPair4_J105 N371 Scratch7_2 P428 DR
R§SPPair4_R73 VDD N371 100k
J§SPPair4_J106 VDD N371 P429 DR
R§SPPair4_R74 P429 N357 1k
R§SPPair4_R75 N357 VSS 4.8k
J§SPPair4_J107 N371 N342 P430 DR
J§SPPair4_J108 N375 N357 0 DR
R§SPPair4_R76 VDD N375 50k
J§SPPair4_J109 VDD N375 P431 DR
R§SPPair4_R77 P431 N380 1k
R§SPPair4_R78 N380 VSS 4.5k
J§SPPair4_J110 P428 N339 0 DR
J§SPPair4_J111 P430 Bus2 0 DR
J§SPPair4_J112 N361 Scratch7_2 0 DR
J§SPPair4_J114 15SPMux2 Scratch011 N361 DR
R§SPPair4_R79 VDD N335 100k
J§SPPair4_J115 VDD N335 P432 DR
R§SPPair4_R80 P432 N339 1k
R§SPPair4_R81 N339 VSS 4.8k
J§SPPair4_J116 N336 N339 0 DR
R§SPPair4_R82 VDD N336 50k
J§SPPair4_J117 VDD N336 P433 DR
R§SPPair4_R83 P433 N342 1k
R§SPPair4_R84 VSS N342 4.5k
J§SPPair4_J118 N335 Scratch_Load P434 DR
J§SPPair4_J119 P434 Scratch011 P435 DR
J§SPPair4_J120 P435 ScratchPad_Word2 0 DR
J§SPPair4_J121 N394 N398 P436 DR
R§SPPair4_R85 VDD N394 100k
J§SPPair4_J122 VDD N394 P437 DR
R§SPPair4_R86 P437 Scratch7_1 1k
R§SPPair4_R87 Scratch7_1 VSS 4.8k
J§SPPair4_J123 N394 N408 0 DR
J§SPPair4_J124 N429 N424 P438 DR
R§SPPair4_R88 VDD N429 100k
J§SPPair4_J125 VDD N429 P439 DR
R§SPPair4_R89 P439 N408 1k
R§SPPair4_R90 N408 VSS 4.8k
J§SPPair4_J126 N429 Scratch7_1 0 DR
J§SPPair4_J127 P436 CLK 0 DR
J§SPPair4_J128 P438 CLK 0 DR
J§SPPair4_J129 N412 Scratch7_1 P440 DR
R§SPPair4_R91 VDD N412 100k
J§SPPair4_J130 VDD N412 P441 DR
R§SPPair4_R92 P441 N398 1k
R§SPPair4_R93 N398 VSS 4.8k
J§SPPair4_J131 N412 N342 P442 DR
J§SPPair4_J132 N418 N398 0 DR
R§SPPair4_R94 VDD N418 50k
J§SPPair4_J133 VDD N418 P443 DR
R§SPPair4_R95 P443 N424 1k
R§SPPair4_R96 N424 VSS 4.5k
J§SPPair4_J134 P440 N339 0 DR
J§SPPair4_J135 P442 Bus1 0 DR
J§SPPair4_J136 N403 Scratch7_1 0 DR
J§SPPair4_J138 15SPMux1 Scratch011 N403 DR
J§SPPair4_J139 N395 N399 P444 DR
R§SPPair4_R97 VDD N395 100k
J§SPPair4_J140 VDD N395 P445 DR
R§SPPair4_R98 P445 Scratch7_0 1k
R§SPPair4_R99 Scratch7_0 VSS 4.8k
J§SPPair4_J141 N395 N409 0 DR
J§SPPair4_J142 N430 N425 P446 DR
R§SPPair4_R100 VDD N430 100k
J§SPPair4_J143 VDD N430 P447 DR
R§SPPair4_R101 P447 N409 1k
R§SPPair4_R102 N409 VSS 4.8k
J§SPPair4_J144 N430 Scratch7_0 0 DR
J§SPPair4_J145 P444 CLK 0 DR
J§SPPair4_J146 P446 CLK 0 DR
J§SPPair4_J147 N413 Scratch7_0 P448 DR
R§SPPair4_R103 VDD N413 100k
J§SPPair4_J148 VDD N413 P449 DR
R§SPPair4_R104 P449 N399 1k
R§SPPair4_R105 N399 VSS 4.8k
J§SPPair4_J149 N413 N342 P450 DR
J§SPPair4_J150 N419 N399 0 DR
R§SPPair4_R106 VDD N419 50k
J§SPPair4_J151 VDD N419 P451 DR
R§SPPair4_R107 P451 N425 1k
R§SPPair4_R108 N425 VSS 4.5k
J§SPPair4_J152 P448 N339 0 DR
J§SPPair4_J153 P450 Bus0 0 DR